# EAGLE design S7G7_footprint_simplified_w_ethernet_v1p7 (EAGLE 9.4.2)
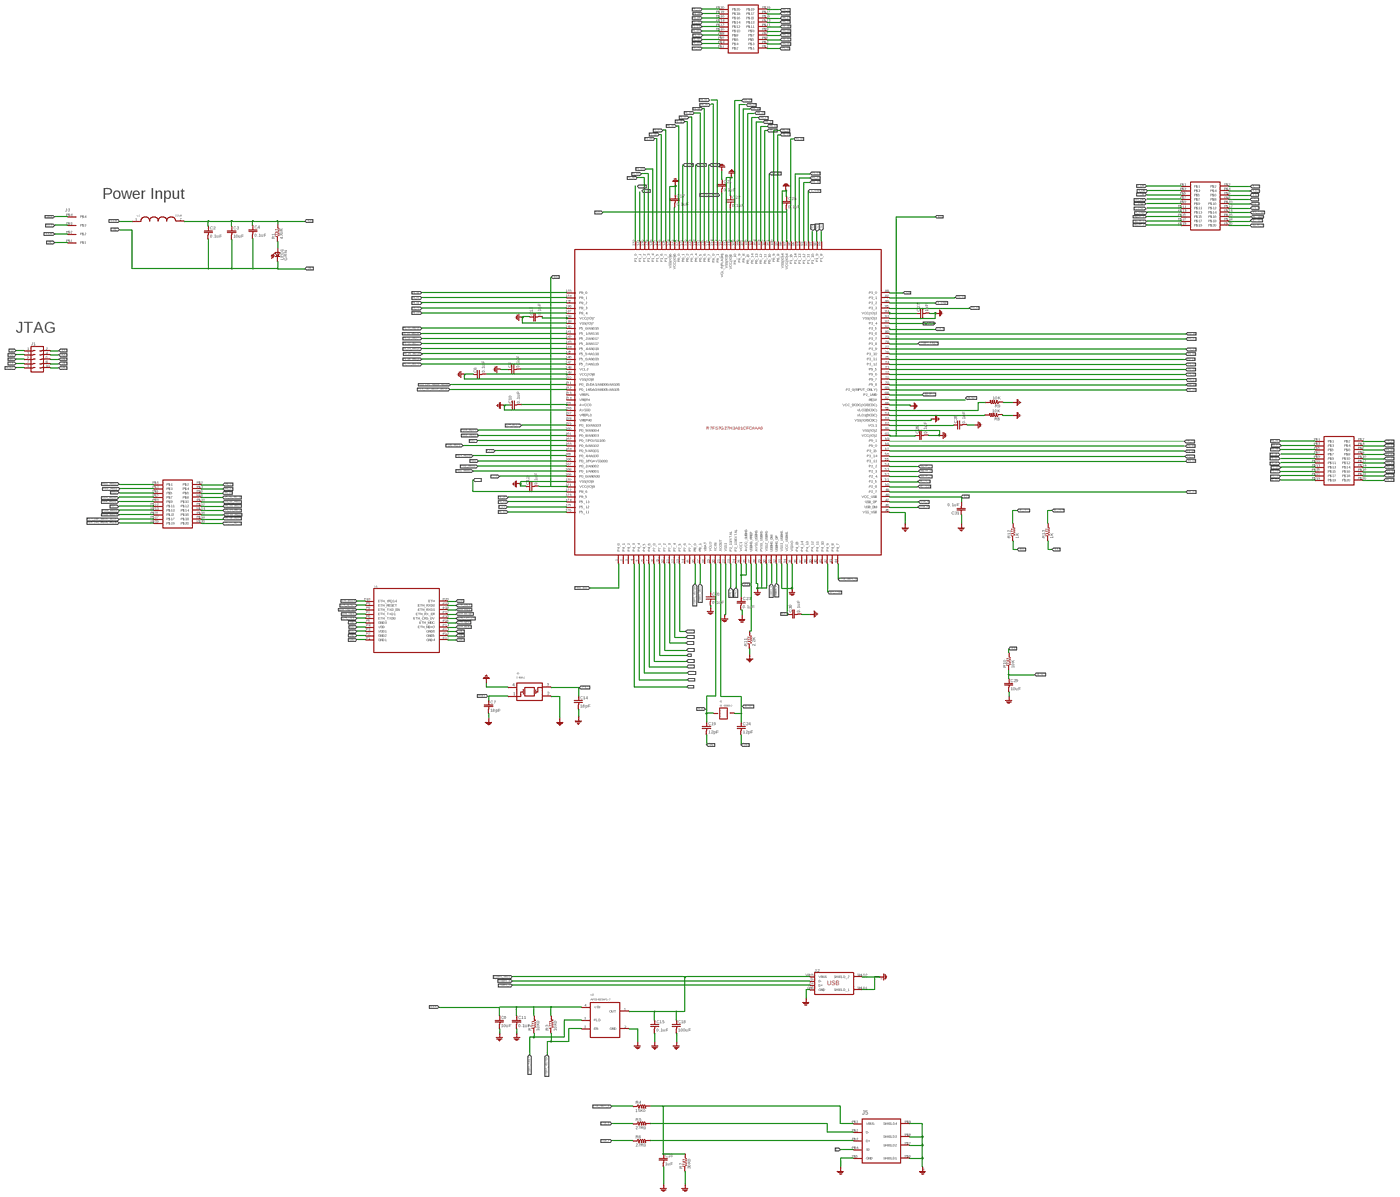
[diagram p0: schematic, sheet 1, overview]
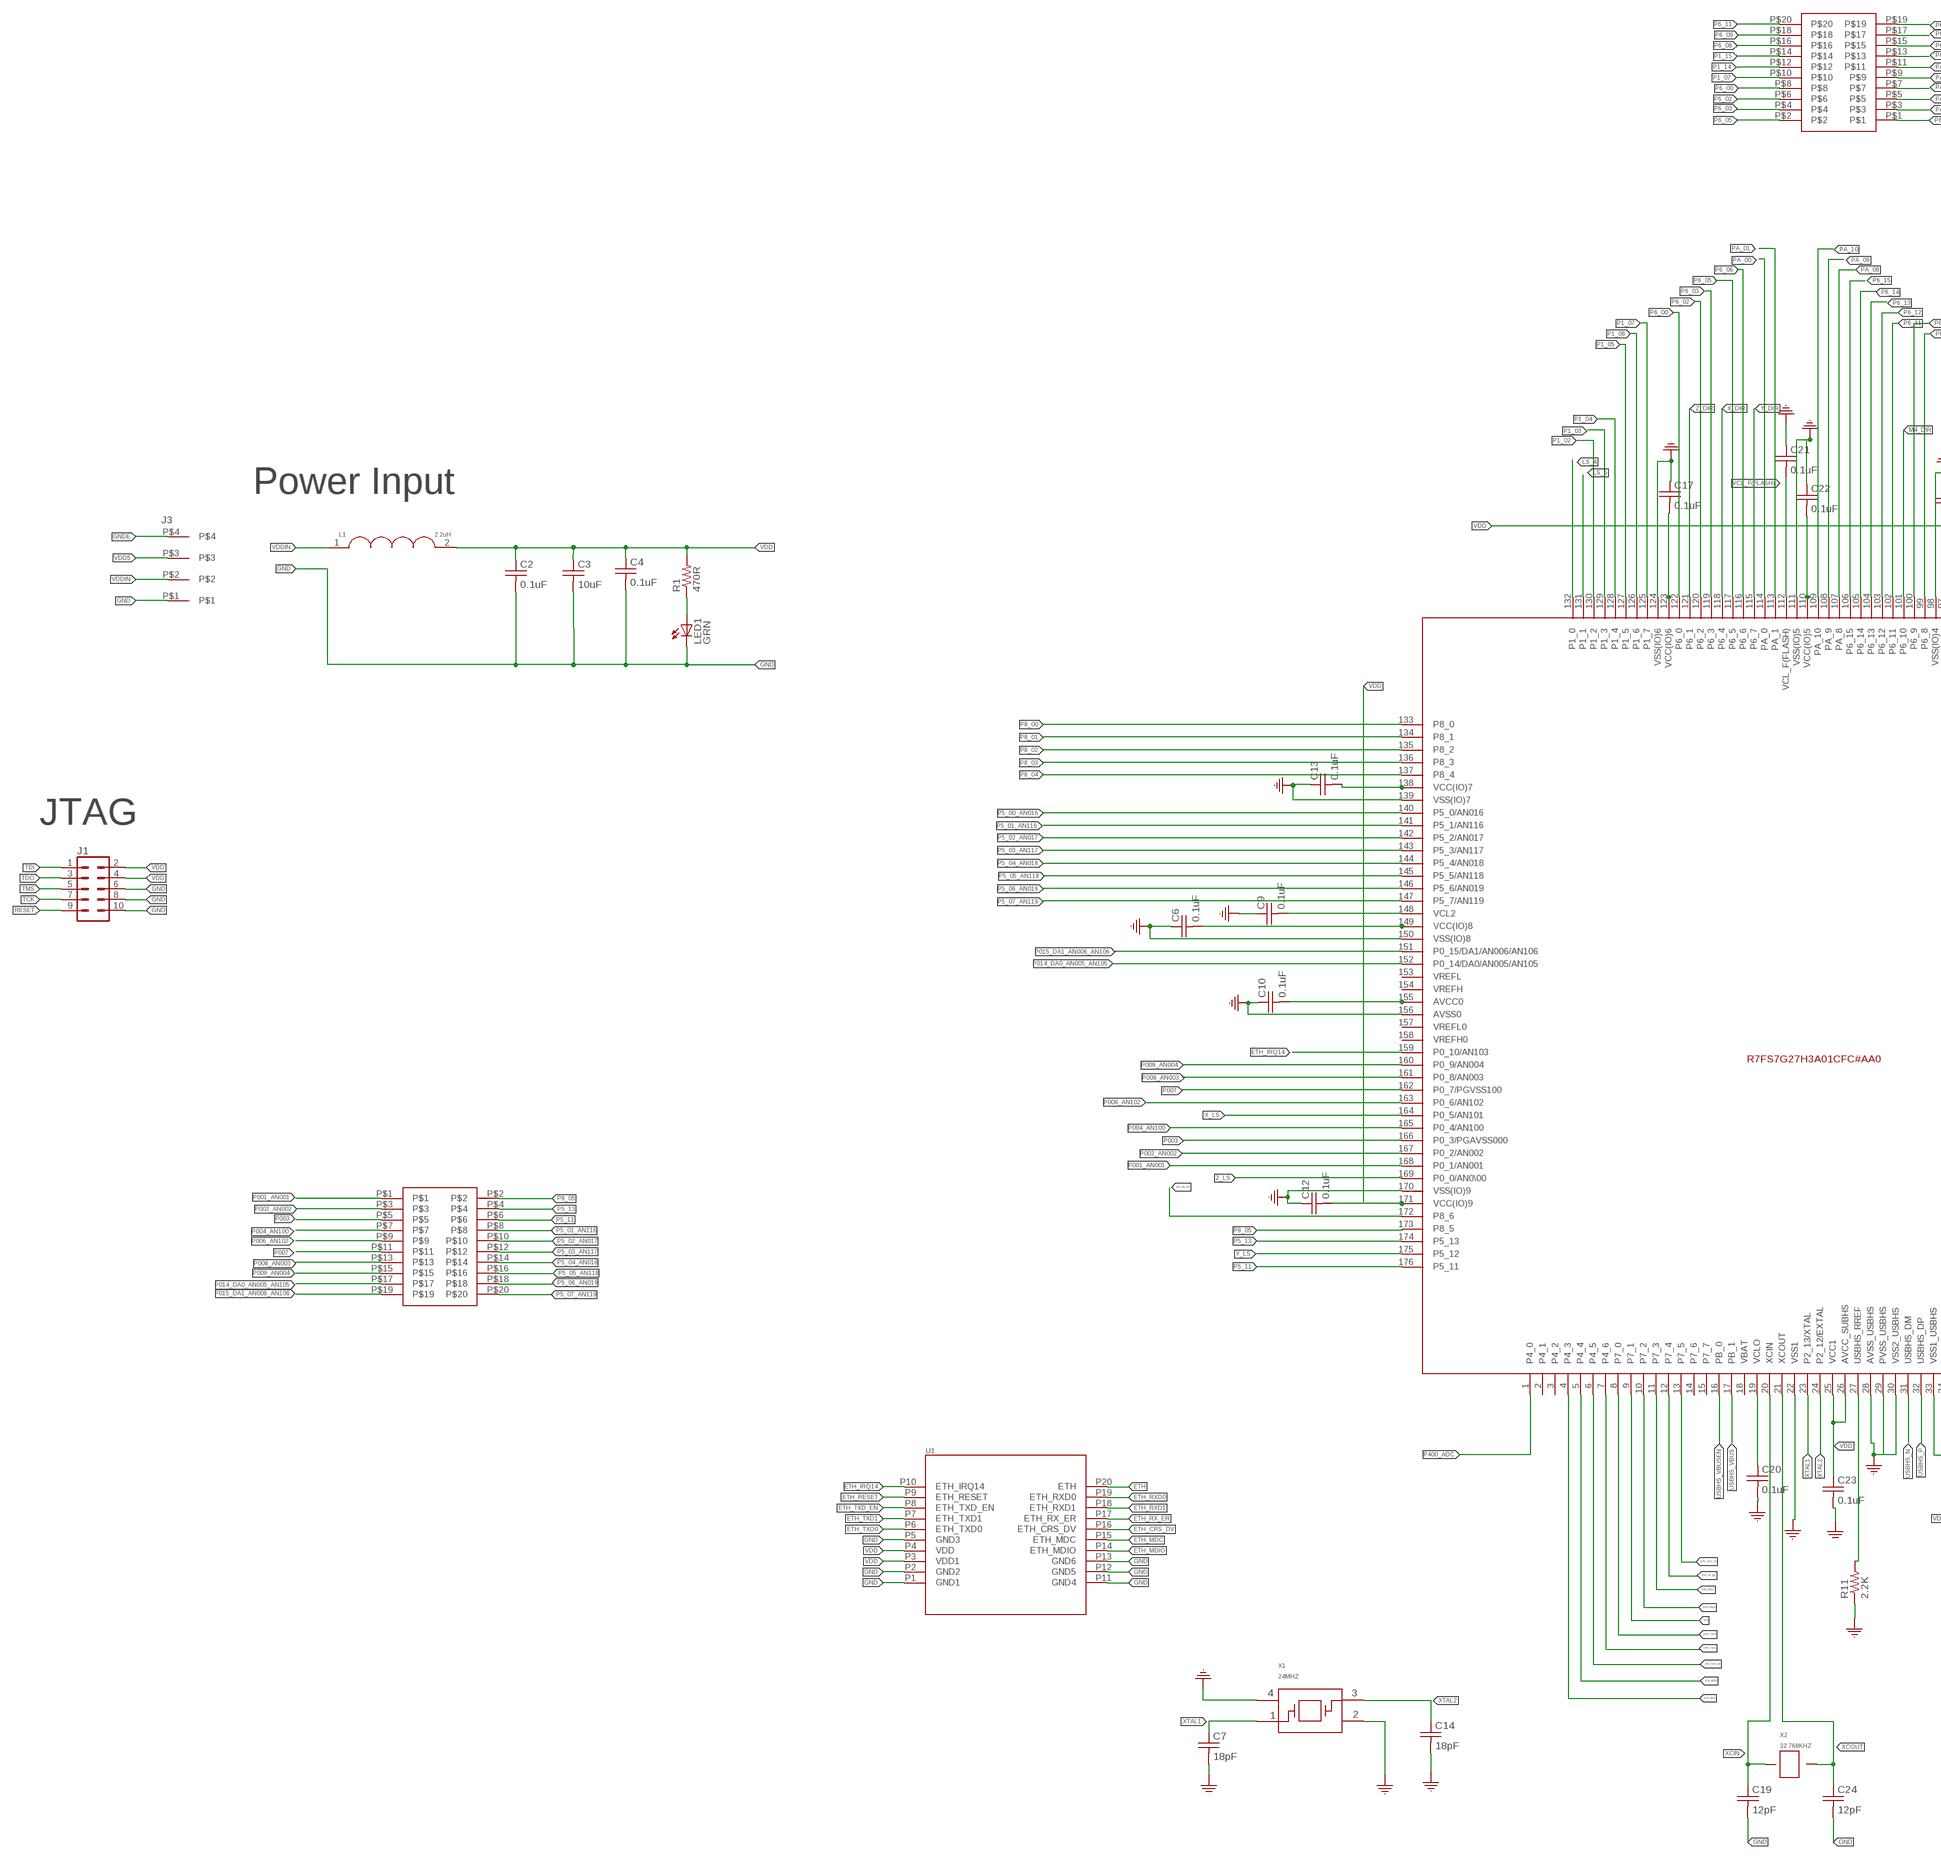
[diagram p1: schematic, sheet 1, part 1 of 4]
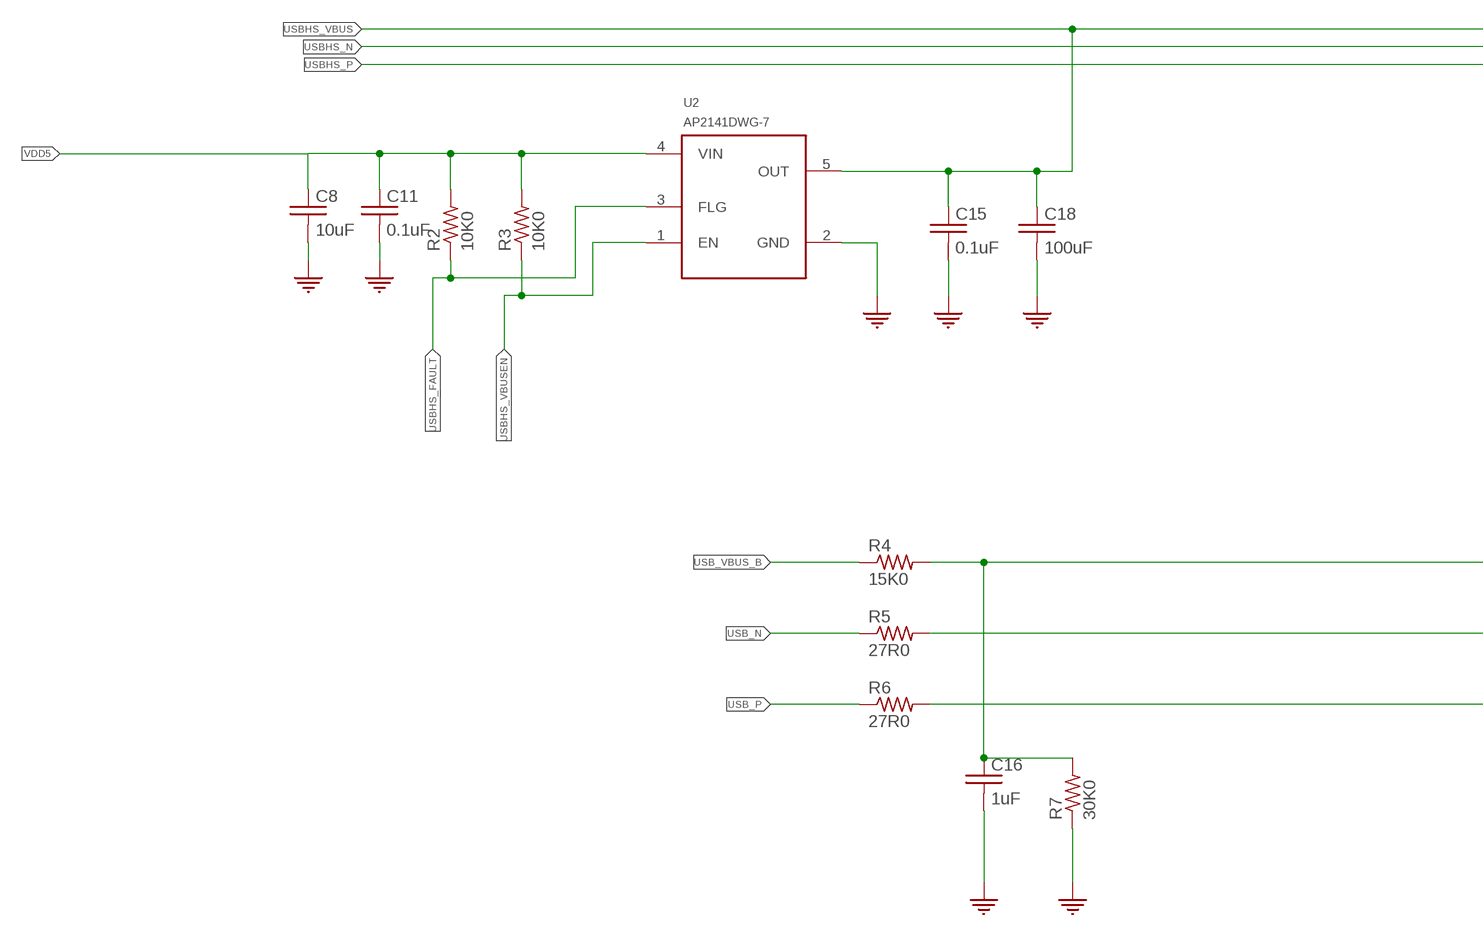
[diagram p2: schematic, sheet 1, part 2 of 4]
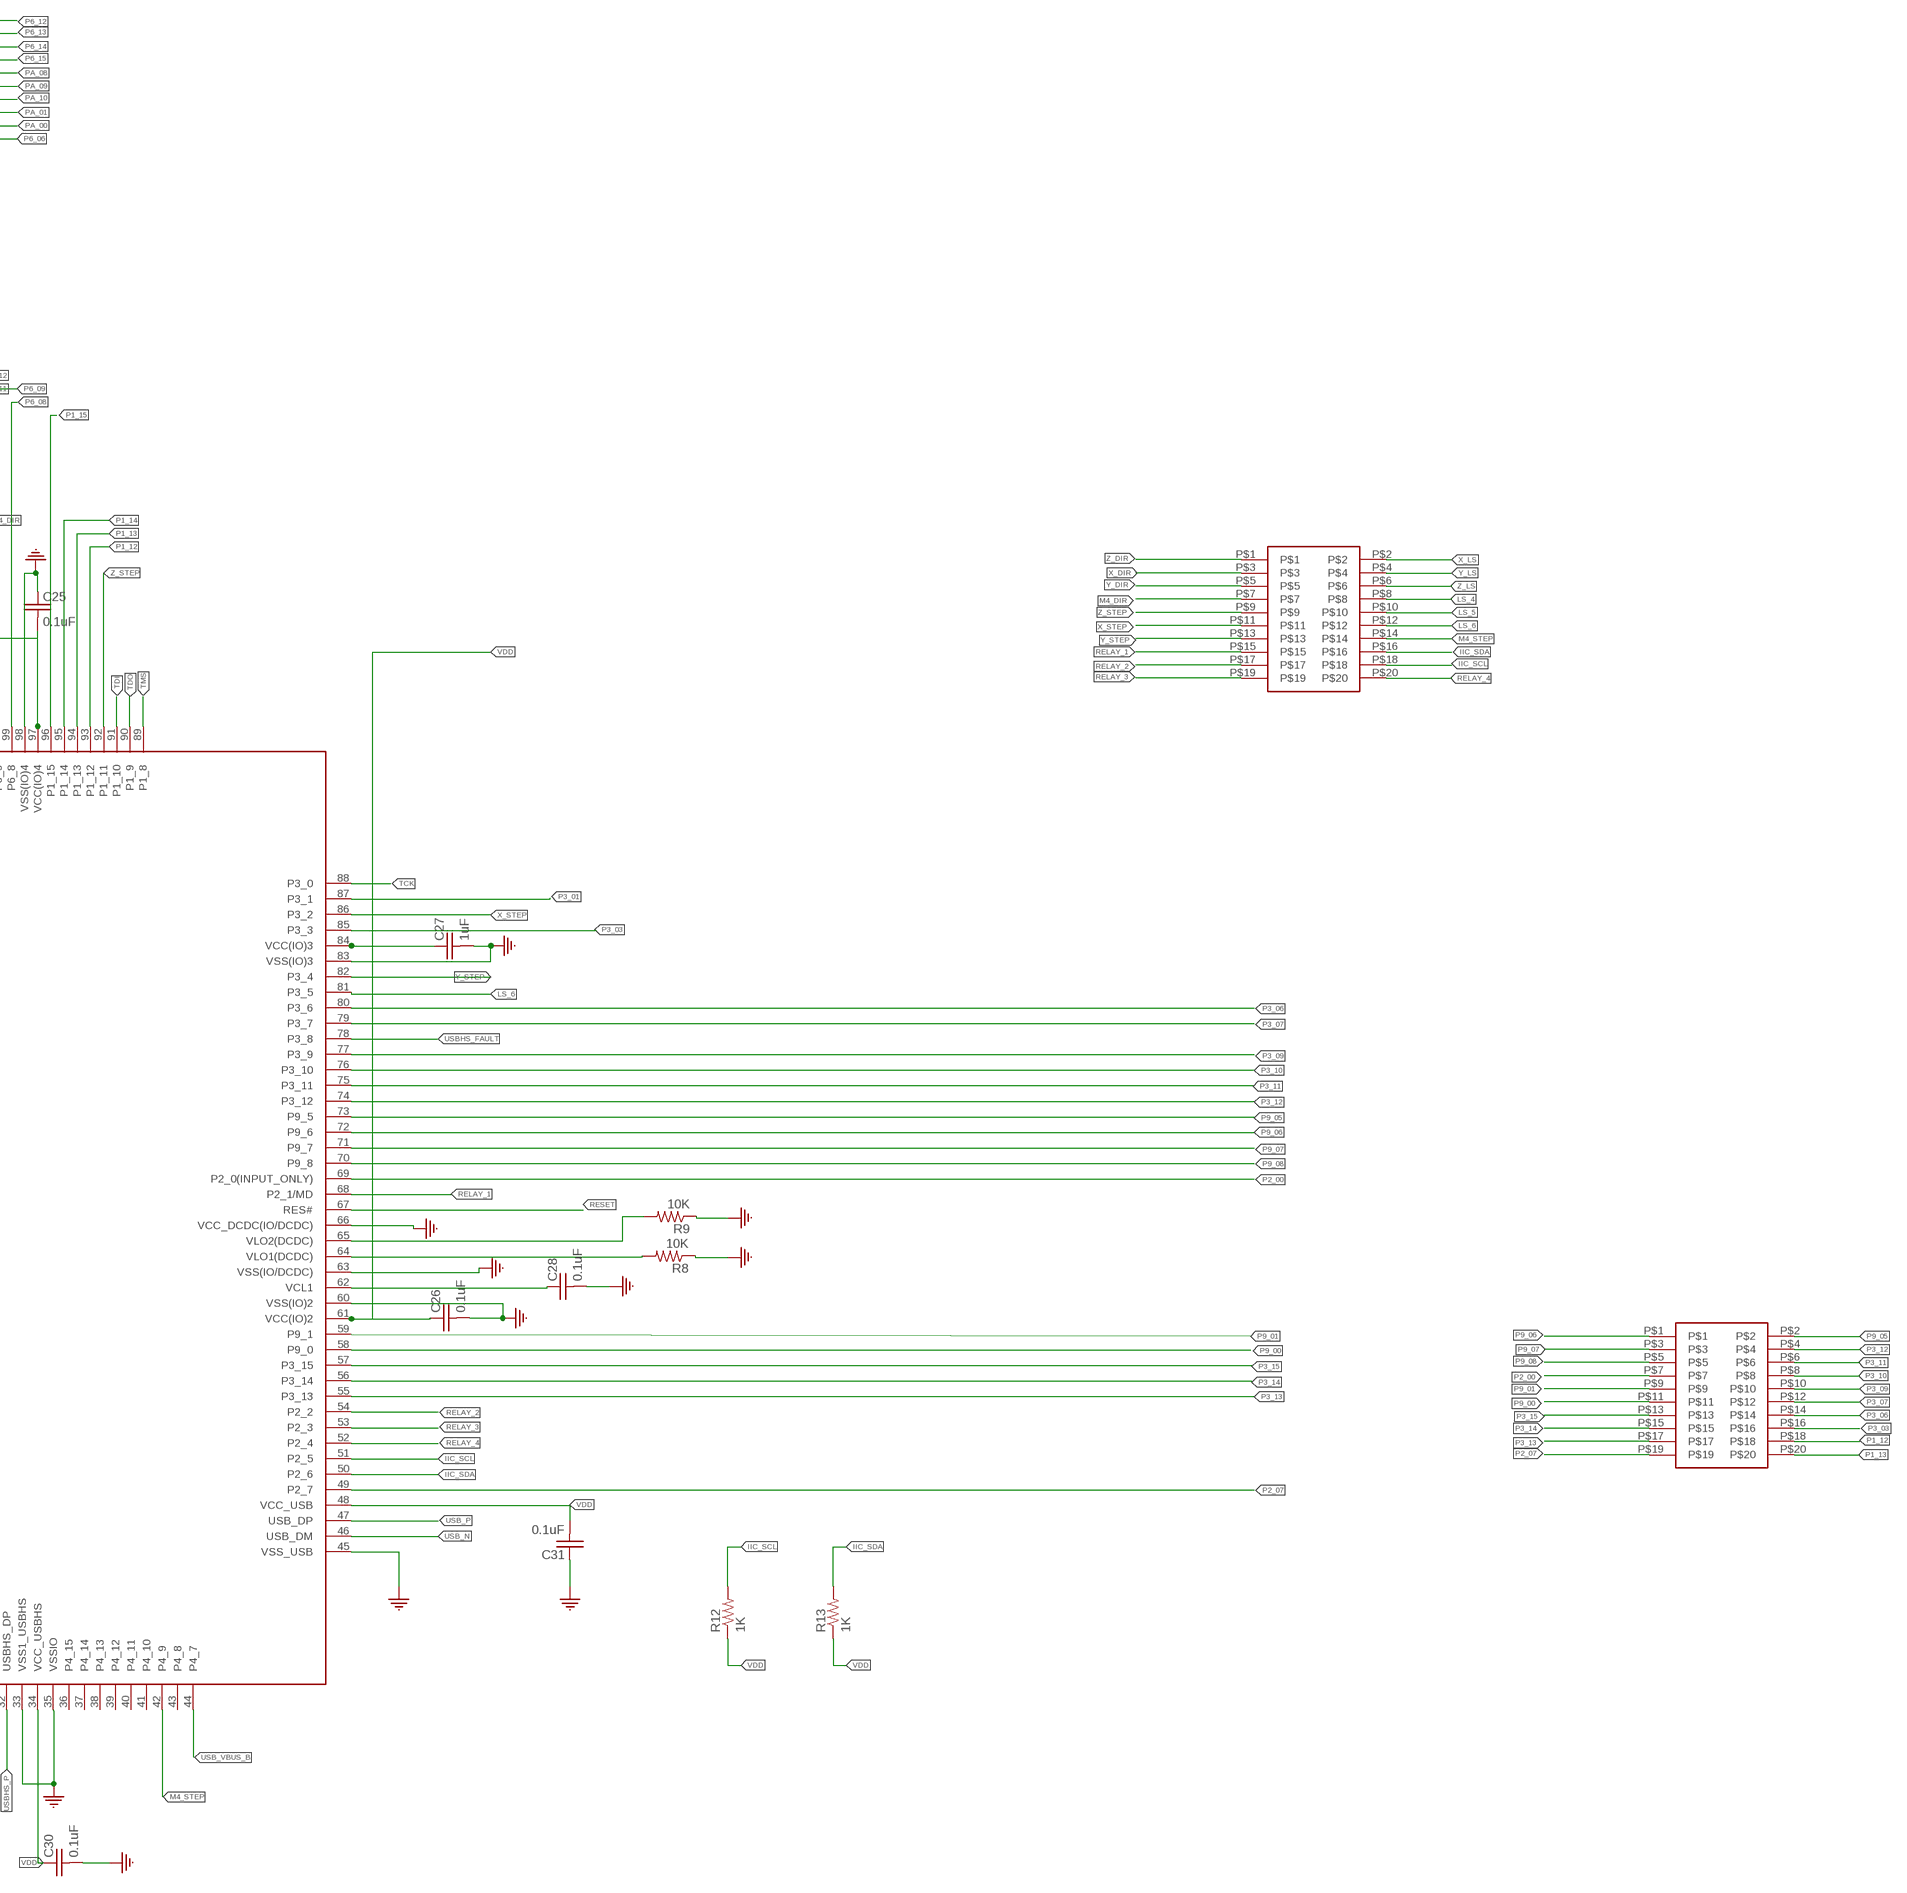
[diagram p3: schematic, sheet 1, part 3 of 4]
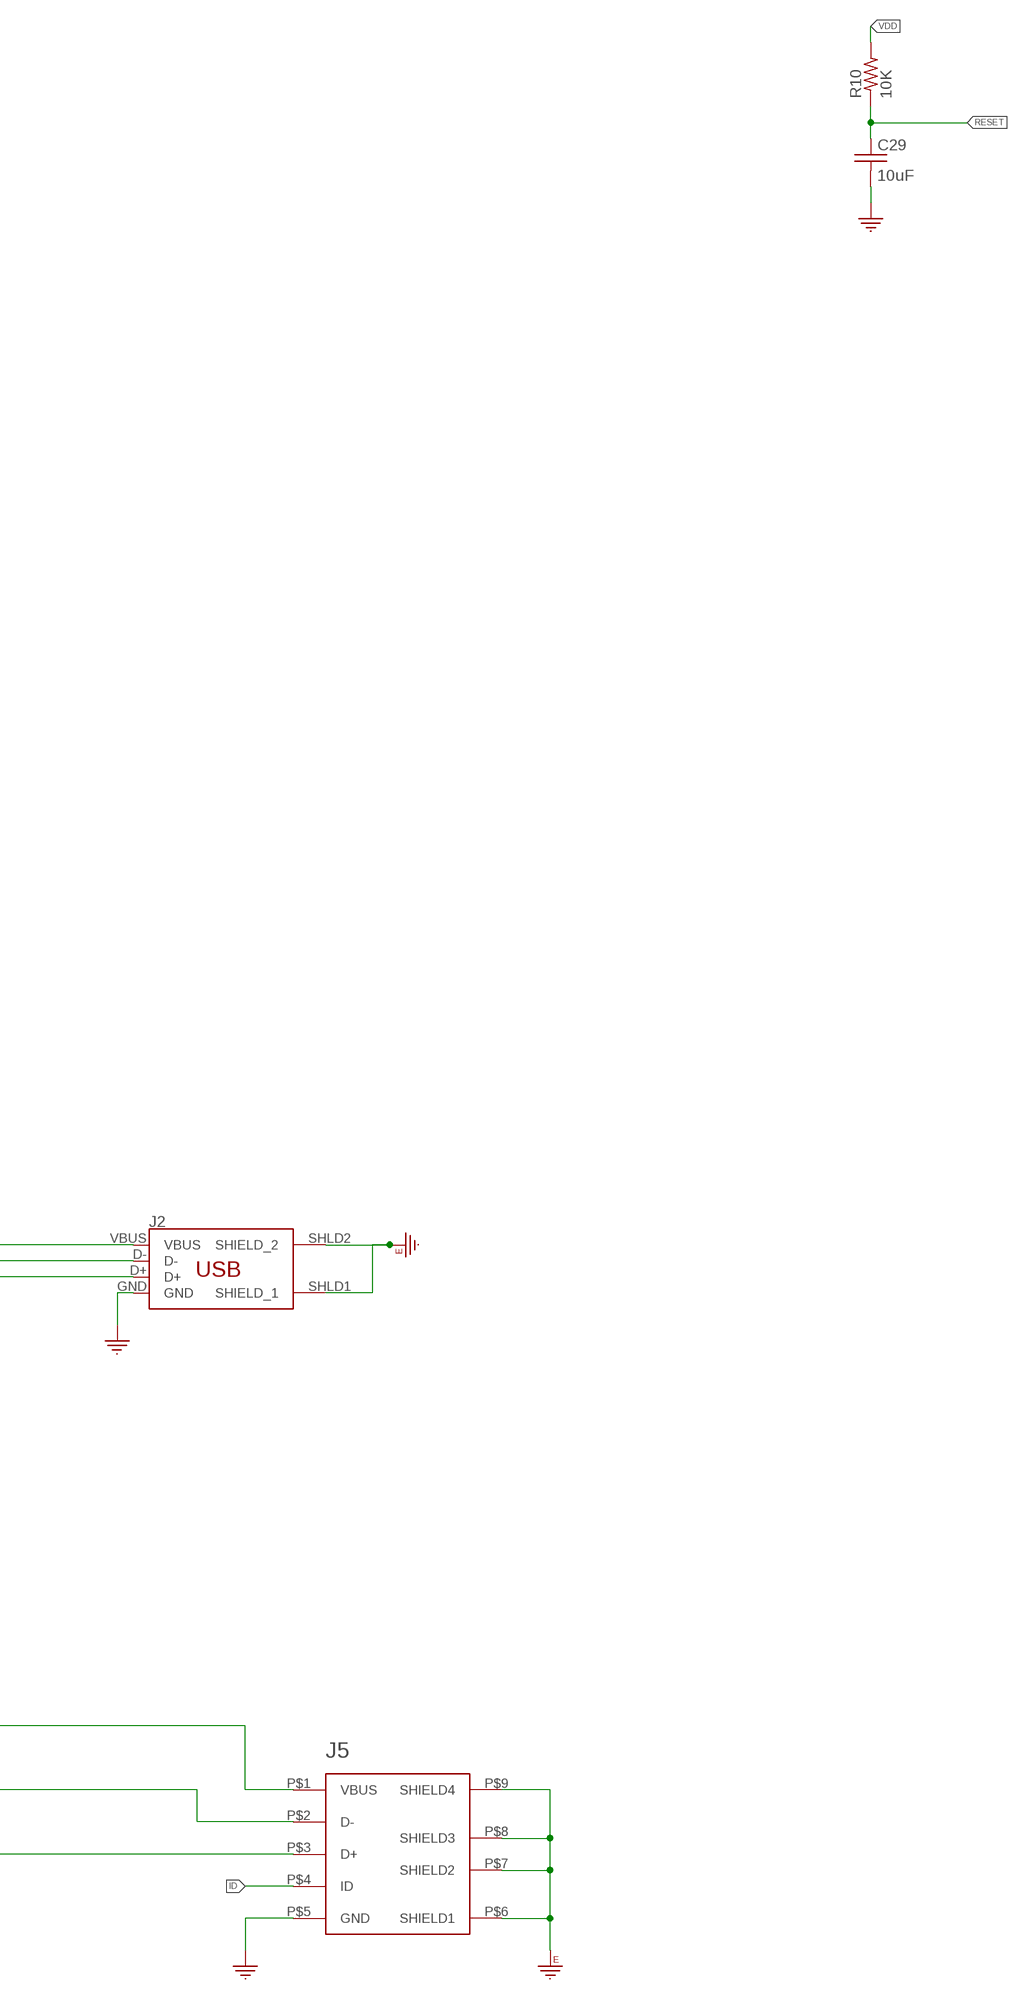
[diagram p4: schematic, sheet 1, part 4 of 4]

## Parts
C2  0.1uF  C_0402  [0402]
C3  10uF  C_0402  [0402]
C4  0.1uF  C_0402  [0402]
C6  0.1uF  C_0402  [0402]
C7  18pF  C_0402  [0402]
C8  10uF  C_0402  [0402]
C9  0.1uF  C_0402  [0402]
C10  0.1uF  C_0402  [0402]
C11  0.1uF  C_0402  [0402]
C12  0.1uF  C_0402  [0402]
C13  0.1uF  C_0402  [0402]
C14  18pF  C_0402  [0402]
C15  0.1uF  C_0402  [0402]
C16  1uF  C_0402  [0402]
C17  0.1uF  C_0402  [0402]
C18  100uF  C_1210  [C1210]
C19  12pF  C_0402  [0402]
C20  0.1uF  C_0402  [0402]
C21  0.1uF  C_0402  [0402]
C22  0.1uF  C_0402  [0402]
C23  0.1uF  C_0402  [0402]
C24  12pF  C_0402  [0402]
C25  0.1uF  C_0402  [0402]
C26  0.1uF  C_0402  [0402]
C27  1uF  C_0402  [0402]
C28  0.1uF  C_0402  [0402]
C29  10uF  C_0402  [0402]
C30  0.1uF  C_0402  [0402]
C31  0.1uF  C_0402  [0402]
J1  CONN_05X2PTH  [2X5]
J2  USB_A  [USB_A_SMT]
J3  3.81MM_1_X_4_RT_ANGLE_PLUG_HEADER  [1X4_3.81MM_PITCH]
J4  2_X_10_HEADER_GENERIC  [2_X_10_.1_INCH]
J5  USB_MICRO-B  [USB_MICRO-B]
JP1  2_X_10_HEADER_GENERIC  [2_X_10_.1_INCH]
JP2  2_X_10_HEADER_GENERIC  [2_X_10_.1_INCH]
JP3  2_X_10_HEADER_GENERIC  [2_X_10_.1_INCH]
L1  2.2uH  INDUCTOR_1008_2.2_MH_1.3A  [1008_(2520_METRIC)]
LED1  LED_0805_GREEN  [LED_0805_GREEN]
R1  470R  R_0402  [0402]
R2  10K0  R_0402  [0402]
R3  10K0  R_0402  [0402]
R4  15K0  R_0402  [0402]
R5  27R0  R_0402  [0402]
R6  27R0  R_0402  [0402]
R7  30K0  R_0402  [0402]
R8  10K  R_0402  [0402]
R9  10K  R_0402  [0402]
R10  10K  R_0402  [0402]
R11  2.2K  R_0402  [0402]
R12  1K  R_0402  [0402]
R13  1K  R_0402  [0402]
U1  ETHERNET_HAT  [ETHERNET_HAT]
U2  AP2141DWG-5  [SOT-23-5]
U5  S7G2_X_176  [LQFP176_24X24]
X1  24MHZ  XTAL_24_MHZ  [SMD_3225]
X2  32.768KHZ  XTAL_32.768KHZ  [SMD_X_2_PADS]

## Nets
D+: J5.P$3(D+) R6.P$2
D-: J5.P$2(D-) R5.P$2
ETH: U1.P20(ETH) U5.9(P7_1)
ETH_CRS_DV: U1.P16(ETH_CRS_DV) U5.13(P7_5)
ETH_IRQ14: U1.P10(ETH_IRQ14) U5.159(P0_10/AN103)
ETH_MDC: U1.P15(ETH_MDC) U5.4(P4_3)
ETH_MDIO: U1.P14(ETH_MDIO) U5.5(P4_4)
ETH_RESET: U1.P9(ETH_RESET) U5.172(P8_6)
ETH_RX_ER: U1.P17(ETH_RX_ER) U5.12(P7_4)
ETH_RXD0: U1.P19(ETH_RXD0) U5.10(P7_2)
ETH_RXD1: U1.P18(ETH_RXD1) U5.11(P7_3)
ETH_TXD0: U1.P6(ETH_TXD0) U5.8(P7_0)
ETH_TXD1: U1.P7(ETH_TXD1) U5.7(P4_6)
ETH_TXD_EN: U1.P8(ETH_TXD_EN) U5.6(P4_5)
GND: C2.P$2 C3.P$2 C4.P$2 C6.P$1 C7.P$2 C8.P$2 C9.P$1 C10.P$1 C11.P$2 C12.P$1 C13.P$1 C14.P$2 C15.P$2 C16.P$2 C17.P$1 C18.2 C19.P$2 C20.P$2 C21.P$1 C22.P$1 C23.P$2 C24.P$2 C25.P$1 C26.P$2 C27.P$2 C28.P$2 C29.P$2 C30.P$2 C31.P$1 J1.6 J1.8 J1.10 J2.GND J3.P$1 J5.P$5(GND) LED1.C R7.P$1 R8.P$1 R9.P$1 R11.P$1 U1.P1(GND1) U1.P2(GND2) U1.P5(GND3) U1.P11(GND4) U1.P12(GND5) U1.P13(GND6) U2.2(GND) U5.22(VSS1) U5.28(AVSS_USBHS) U5.29(PVSS_USBHS) U5.30(VSS2_USBHS) U5.33(VSS1_USBHS) U5.35(VSSIO) U5.45(VSS_USB) U5.60(VSS(IO)2) U5.63(VSS(IO/DCDC)) U5.66(VCC_DCDC(IO/DCDC)) U5.83(VSS(IO)3) U5.98(VSS(IO)4) U5.111(VSS(IO)5) U5.124(VSS(IO)6) U5.139(VSS(IO)7) U5.150(VSS(IO)8) U5.156(AVSS0) U5.170(VSS(IO)9) X1.2 X1.4
GNDE: J2.SHLD1(SHIELD_1) J2.SHLD2(SHIELD_2) J3.P$4 J5.P$6(SHIELD1) J5.P$7(SHIELD2) J5.P$8(SHIELD3) J5.P$9(SHIELD4)
ID: J5.P$4(ID)
IIC_SCL: J4.P$18 R12.P$2 U5.51(P2_5)
IIC_SDA: J4.P$16 R13.P$2 U5.50(P2_6)
LS_4: J4.P$8 U5.132(P1_0)
LS_5: J4.P$10 U5.131(P1_1)
LS_6: J4.P$12 U5.81(P3_5)
M4_DIR: J4.P$7 U5.101(P6_10)
M4_STEP: J4.P$14 U5.42(P4_9)
N$2: R11.P$2 U5.27(USBHS_RREF)
N$7: LED1.A R1.P$1
N$9: C9.P$2 U5.148(VCL2)
N$14: C20.P$1 U5.19(VCLO)
N$17: C28.P$1 U5.62(VCL1)
N$18: R8.P$2 U5.64(VLO1(DCDC))
N$19: R9.P$2 U5.65(VLO2(DCDC))
P1_02: U5.130(P1_2)
P1_03: U5.129(P1_3)
P1_04: U5.128(P1_4)
P1_05: U5.127(P1_5)
P1_06: U5.126(P1_6)
P1_07: JP3.P$10 U5.125(P1_7)
P1_12: JP2.P$18 U5.93(P1_12)
P1_13: JP2.P$20 U5.94(P1_13)
P1_14: JP3.P$12 U5.95(P1_14)
P1_15: JP3.P$14 U5.96(P1_15)
P001_AN001: JP1.P$1 U5.168(P0_1/AN001)
P2_00: JP2.P$7 U5.69(P2_0(INPUT_ONLY))
P2_07: JP2.P$19 U5.49(P2_7)
P002_AN002: JP1.P$3 U5.167(P0_2/AN002)
P003: JP1.P$5 U5.166(P0_3/PGAVSS000)
P3_01: U5.87(P3_1)
P3_03: JP2.P$16 U5.85(P3_3)
P3_06: JP2.P$14 U5.80(P3_6)
P3_07: JP2.P$12 U5.79(P3_7)
P3_09: JP2.P$10 U5.77(P3_9)
P3_10: JP2.P$8 U5.76(P3_10)
P3_11: JP2.P$6 U5.75(P3_11)
P3_12: JP2.P$4 U5.74(P3_12)
P3_13: JP2.P$17 U5.55(P3_13)
P3_14: JP2.P$15 U5.56(P3_14)
P3_15: JP2.P$13 U5.57(P3_15)
P004_AN100: JP1.P$7 U5.165(P0_4/AN100)
P5_00_AN016: U5.140(P5_0/AN016)
P5_01_AN116: JP1.P$8 U5.141(P5_1/AN116)
P5_02_AN017: JP1.P$10 U5.142(P5_2/AN017)
P5_03_AN117: JP1.P$12 U5.143(P5_3/AN117)
P5_04_AN018: JP1.P$14 U5.144(P5_4/AN018)
P5_05_AN118: JP1.P$16 U5.145(P5_5/AN118)
P5_06_AN019: JP1.P$18 U5.146(P5_6/AN019)
P5_07_AN119: JP1.P$20 U5.147(P5_7/AN119)
P5_11: JP1.P$6 U5.176(P5_11)
P5_13: JP1.P$4 U5.174(P5_13)
P6_00: JP3.P$8 U5.122(P6_0)
P6_02: JP3.P$6 U5.120(P6_2)
P6_03: JP3.P$4 U5.119(P6_3)
P6_05: JP3.P$2 U5.117(P6_5)
P6_06: JP3.P$1 U5.116(P6_6)
P6_08: JP3.P$16 U5.99(P6_8)
P6_09: JP3.P$18 U5.100(P6_9)
P6_11: JP3.P$20 U5.102(P6_11)
P6_12: JP3.P$19 U5.103(P6_12)
P6_13: JP3.P$17 U5.104(P6_13)
P6_14: JP3.P$15 U5.105(P6_14)
P6_15: JP3.P$13 U5.106(P6_15)
P006_AN102: JP1.P$9 U5.163(P0_6/AN102)
P007: JP1.P$11 U5.162(P0_7/PGVSS100)
P8_00: U5.133(P8_0)
P8_01: U5.134(P8_1)
P8_02: U5.135(P8_2)
P8_03: U5.136(P8_3)
P8_04: U5.137(P8_4)
P8_05: JP1.P$2 U5.173(P8_5)
P008_AN003: JP1.P$13 U5.161(P0_8/AN003)
P9_00: JP2.P$11 U5.58(P9_0)
P9_01: JP2.P$9 U5.59(P9_1)
P9_05: JP2.P$2 U5.73(P9_5)
P9_06: JP2.P$1 U5.72(P9_6)
P9_07: JP2.P$3 U5.71(P9_7)
P9_08: JP2.P$5 U5.70(P9_8)
P009_AN004: JP1.P$15 U5.160(P0_9/AN004)
P014_DA0_AN005_AN105: JP1.P$17 U5.152(P0_14/DA0/AN005/AN105)
P015_DA1_AN006_AN106: JP1.P$19 U5.151(P0_15/DA1/AN006/AN106)
P400_ADC: U5.1(P4_0)
P706: U5.14(P7_6)
PA_00: JP3.P$3 U5.114(PA_0)
PA_01: JP3.P$5 U5.113(PA_1)
PA_08: JP3.P$11 U5.107(PA_8)
PA_09: JP3.P$9 U5.108(PA_9)
PA_10: JP3.P$7 U5.109(PA_10)
RELAY_1: J4.P$15 U5.68(P2_1/MD)
RELAY_2: J4.P$17 U5.54(P2_2)
RELAY_3: J4.P$19 U5.53(P2_3)
RELAY_4: J4.P$20 U5.52(P2_4)
RESET: C29.P$1 J1.9 R10.P$1 U5.67(RES#)
TCK: J1.7 U5.88(P3_0)
TDI: J1.1 U5.91(P1_10)
TDO: J1.3 U5.90(P1_9)
TMS: J1.5 U5.89(P1_8)
USB_N: R5.P$1 U5.46(USB_DM)
USB_P: R6.P$1 U5.47(USB_DP)
USB_VBUS_B: R4.P$1 U5.44(P4_7)
USBHS_FAULT: R2.P$1 U2.3(FLG) U5.78(P3_8)
USBHS_N: J2.D- U5.31(USBHS_DM)
USBHS_P: J2.D+ U5.32(USBHS_DP)
USBHS_VBUS: C15.P$1 C18.1 J2.VBUS U2.5(OUT) U5.17(PB_1)
USBHS_VBUSEN: R3.P$1 U2.1(EN) U5.16(PB_0)
VBUS: C16.P$1 J5.P$1(VBUS) R4.P$2 R7.P$2
VCL_F(FLASH): C21.P$2 U5.112(VCL_F(FLASH))
VDD: C2.P$1 C3.P$1 C4.P$1 C6.P$2 C10.P$2 C12.P$2 C13.P$2 C17.P$2 C22.P$2 C23.P$1 C25.P$2 C26.P$1 C27.P$1 C30.P$1 C31.P$2 J1.2 J1.4 L1.2 R1.P$2 R10.P$2 R12.P$1 R13.P$1 U1.P3(VDD1) U1.P4(VDD) U5.25(VCC1) U5.26(AVCC_SUBHS) U5.34(VCC_USBHS) U5.48(VCC_USB) U5.61(VCC(IO)2) U5.84(VCC(IO)3) U5.97(VCC(IO)4) U5.110(VCC(IO)5) U5.123(VCC(IO)6) U5.138(VCC(IO)7) U5.149(VCC(IO)8) U5.155(AVCC0) U5.171(VCC(IO)9)
VDD5: C8.P$1 C11.P$1 J3.P$3 R2.P$2 R3.P$2 U2.4(VIN)
VDDIN: J3.P$2 L1.1
X_DIR: J4.P$3 U5.118(P6_4)
X_LS: J4.P$2 U5.164(P0_5/AN101)
X_STEP: J4.P$11 U5.86(P3_2)
XCIN: C19.P$1 U5.20(XCIN) X2.P$1
XCOUT: C24.P$1 U5.21(XCOUT) X2.P$2
XTAL1: C7.P$1 U5.23(P2_13/XTAL) X1.1
XTAL2: C14.P$1 U5.24(P2_12/EXTAL) X1.3
Y_DIR: J4.P$5 U5.115(P6_7)
Y_LS: J4.P$4 U5.175(P5_12)
Y_STEP: J4.P$13 U5.82(P3_4)
Z_DIR: J4.P$1 U5.121(P6_1)
Z_LS: J4.P$6 U5.169(P0_0/AN0\00)
Z_STEP: J4.P$9 U5.92(P1_11)
Unconnected: U5.2(P4_1) U5.3(P4_2) U5.15(P7_7) U5.18(VBAT) U5.36(P4_15) U5.37(P4_14) U5.38(P4_13) U5.39(P4_12) U5.40(P4_11) U5.41(P4_10) U5.43(P4_8) U5.153(VREFL) U5.154(VREFH) U5.157(VREFL0) U5.158(VREFH0)

## Notes on the sheet
- Power Input
- JTAG

## Library data of the parts
C2-C4 C6-C17 C19-C31 = 3D_MIG_Controller:C_0402
C18 = 3D_MIG_Controller:C_1210
J1 = 3D_MIG_Controller:CONN_05X2: Multi connection point. Often used as Generic Header-pin footprint for 0.1 inch spaced/style header connections For AVR SPI programming port, see special device with nice symbol: "AVR_SPI_PROG_5x2.dev" You can populate with any combo of single row headers, but if you'd like an exact match, check these: 2x5 AVR ICSP Male Header <https://www.sparkfun.com/products/778> (PRT-00778) 2x5 Pin Shrouded Header <https://www.sparkfun.com/products/8506> (PRT-08506) On any of the 0.1 inch spaced packages, you can populate with these: Break Away Headers - Straight <https://www.sparkfun.com/products/116> (PRT-00116) Break Away Male Headers - Right Angle <https://www.sparkfun.com/products/553> (PRT-00553) Female Headers <https://www.sparkfun.com/products/115> (PRT-00115) Break Away Headers - Machine Pin <https://www.sparkfun.com/products/117> (PRT-00117) Break Away Female Headers - Swiss Machine Pin <https://www.sparkfun.com/products/743> (PRT-00743) Special note: the shrouded connector mates well with our 5x2 ribbon cables: 2x5 Pin IDC Ribbon Cable <https://www.sparkfun.com/products/8535> (PRT-08535); PROD_ID: CONN-08499; SF_ID: PRT-0778
J2 = 3D_MIG_Controller:USB_A: USB-A Connector Male and female variants, as well as PTH and SMT variants SparkFun Products: SparkFun XBee Explorer Dongle <https://www.sparkfun.com/products/11697> PTH Male SparkFun MicroView-USB Programmer <https://www.sparkfun.com/products/12924> SMT Male SparkFun USB Type A Female Breakout <https://www.sparkfun.com/products/12700> SMT Female
J3 = 3D_MIG_Controller:3.81MM_1_X_4_RT_ANGLE_PLUG_HEADER
J4 JP1-JP3 = 3D_MIG_Controller:2_X_10_HEADER_GENERIC
J5 = 3D_MIG_Controller:USB_MICRO-B
L1 = 3D_MIG_Controller:INDUCTOR_1008_2.2_MH_1.3A
LED1 = 3D_MIG_Controller:LED_0805_GREEN
R1-R13 = 3D_MIG_Controller:R_0402
U1 = 3D_MIG_Controller:ETHERNET_HAT
U2 = 3D_MIG_Controller:AP2141DWG-5
U5 = 3D_MIG_Controller:S7G2_X_176
X1 = 3D_MIG_Controller:XTAL_24_MHZ
X2 = 3D_MIG_Controller:XTAL_32.768KHZ

## Board
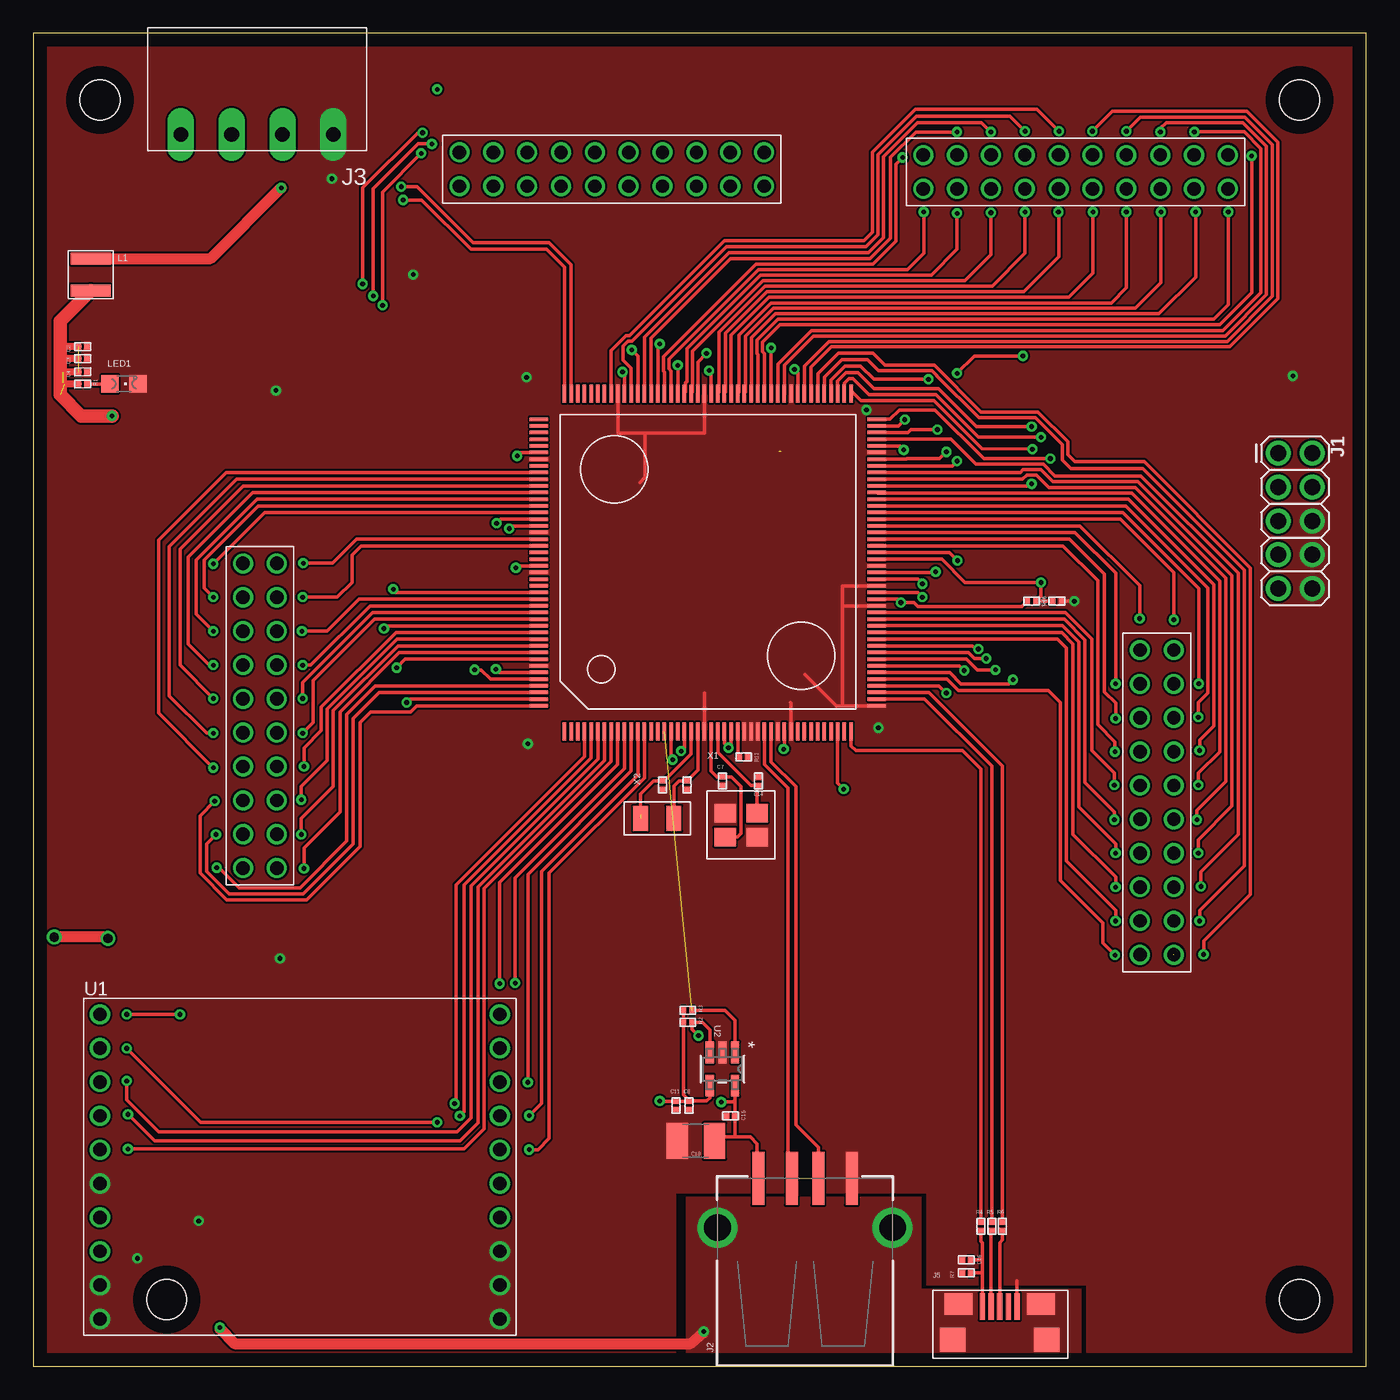
[diagram p5: board, top side]
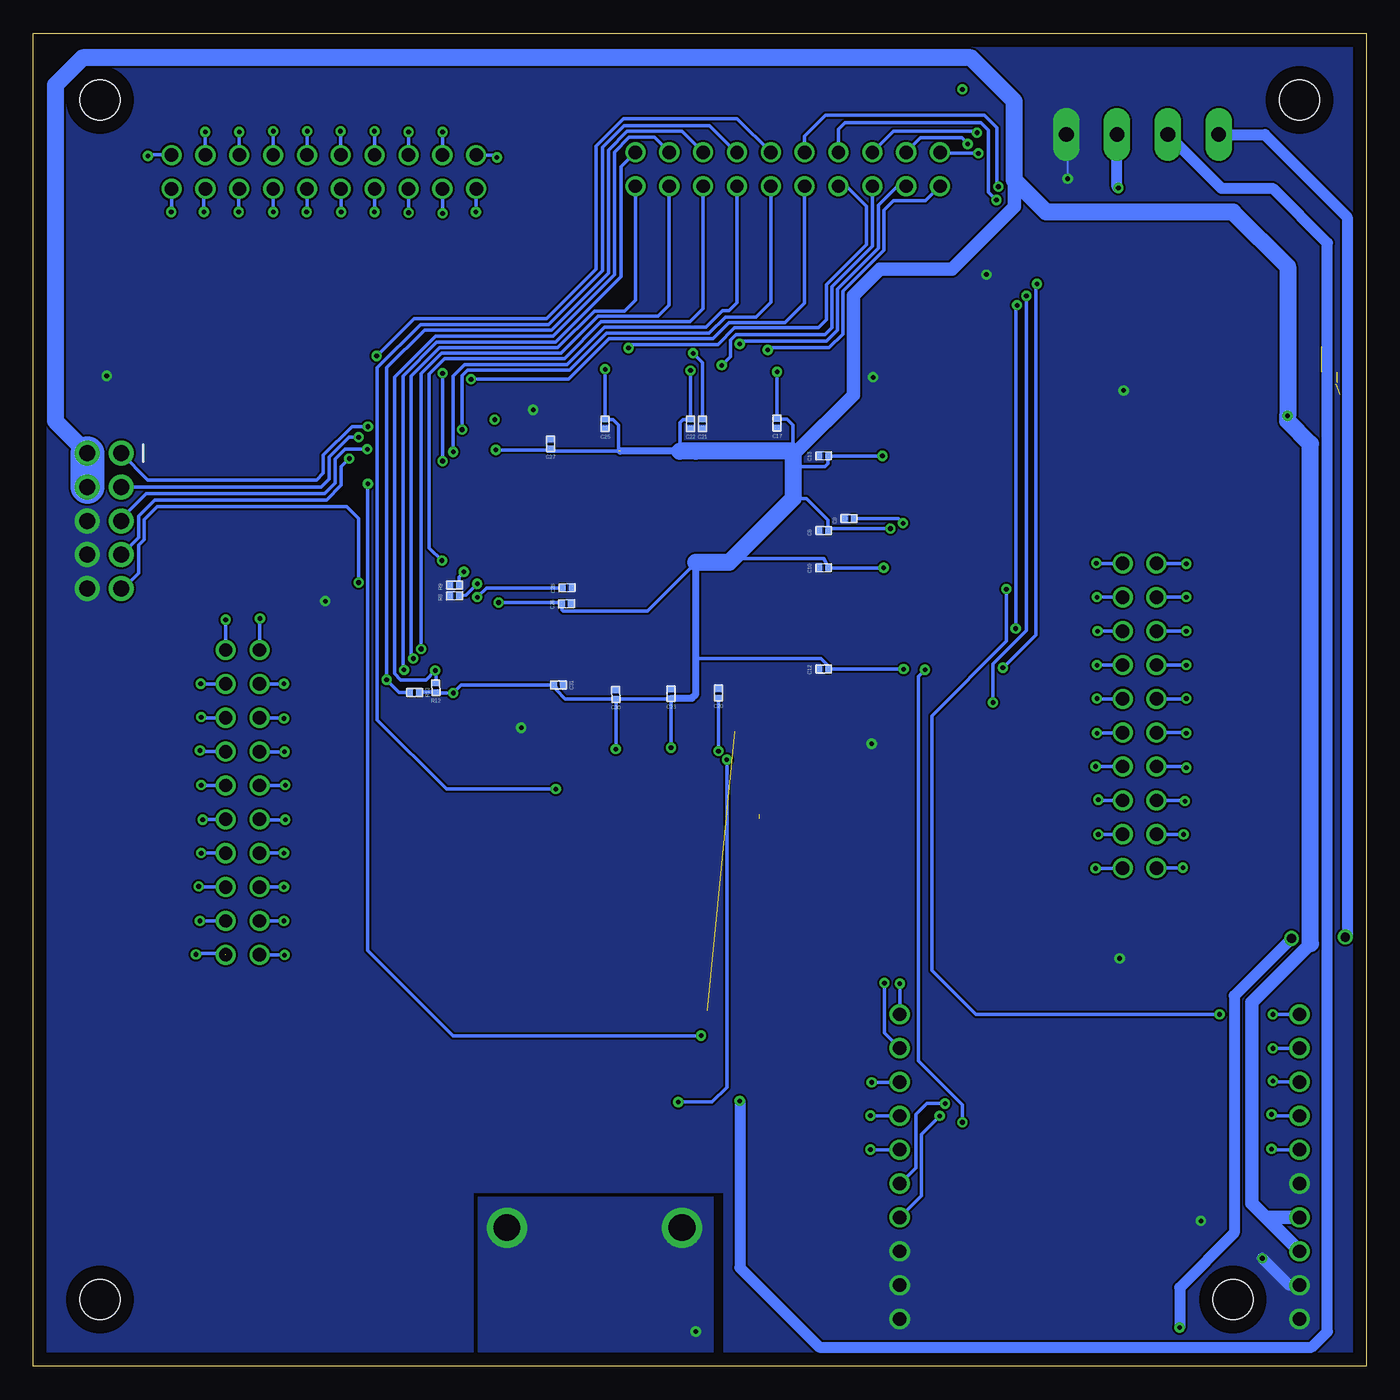
[diagram p6: board, bottom side, seen from below]

Size 100 x 100 mm. Coordinates in mm from the lower left corner, seen from the top.
Outline: 0,0 100,0 100,100 0,100 0,0
Copper layers (1*16): Top 0.035mm / dielectric 1.5mm / Bottom 0.035mm
Design rules "default": minimum track width 6mil, minimum drill 0.35mm, track to track 6mil, track to pad 6mil, pad to pad 6mil, via to via 6mil, smd to smd 6mil, copper to edge 40mil, drill to drill 6mil, minimum pad ring 10mil, minimum via ring 8mil, stop-mask expansion 4mil, vias tented up to drill 0mil, thermal gap 10mil
Holes 3 mm at 5,95 95,95 95,5 10,5

### Footprints (pad centres in the part's own frame; a part is rotated, then mirrored left to right if it is on the bottom)
0402 = smd 0.5 x 0.4: P$1 0,0.325; P$2 0,-0.325
C1210 = smd 1.6 x 2.7: 1 -1.4,0; 2 1.4,0
2X5 = drill 1.2 pad 1.88: 1 0,0; 2 0,2.54; 3 2.54,0; 4 2.54,2.54; 5 5.08,0; 6 5.08,2.54; 7 7.62,0; 8 7.62,2.54; 9 10.16,0; 10 10.16,2.54
USB_A_SMT = smd 4 x 0.9: D+ 6.7,-1; D- 6.7,1; GND 6.7,-3.5; VBUS 6.7,3.5 | drill 2: SHLD1 3,-6.566; SHLD2 3,6.566
1X4_3.81MM_PITCH = drill 1.1 pad 2 long: P$1 0,0; P$2 3.81,0; P$3 7.62,0; P$4 11.43,0
2_X_10_.1_INCH = drill 1: P$1 -11.43,-1.27; P$2 -11.43,1.27; P$3 -8.89,-1.27; P$4 -8.89,1.27; P$5 -6.35,-1.27; P$6 -6.35,1.27; P$7 -3.81,-1.27; P$8 -3.81,1.27; P$9 -1.27,-1.27; P$10 -1.27,1.27; P$11 1.27,-1.27; P$12 1.27,1.27; P$13 3.81,-1.27; P$14 3.81,1.27; P$15 6.35,-1.27; P$16 6.35,1.27; P$17 8.89,-1.27; P$18 8.89,1.27; P$19 11.43,-1.27; P$20 11.43,1.27
USB_MICRO-B = smd 0.4 x 2: P$1 -1.3,2.475; P$2 -0.65,2.475; P$3 0,2.475; P$4 0.65,2.475; P$5 1.3,2.475 | smd 2.1 x 1.6: P$6 -3.1,2.675; P$7 3.1,2.675 | smd 1.9 x 1.8: P$8 -3.525,0; P$9 3.525,0
1008_(2520_METRIC) = smd 3 x 0.9: 1 0,1.2; 2 0,-1.2
LED_0805_GREEN = smd 1.3 x 1.3: A 0,-1.05; C 0,1.05
ETHERNET_HAT = drill 1: P1 -15.3,-10.96; P2 -15.3,-8.42; P3 -15.3,-5.88; P4 -15.3,-3.34; P5 -15.3,-0.8; P6 -15.3,1.74; P7 -15.3,4.28; P8 -15.3,6.82; P9 -15.3,9.36; P10 -15.3,11.9; P11 14.7,-10.96; P12 14.7,-8.42; P13 14.7,-5.88; P14 14.7,-3.34; P15 14.7,-0.8; P16 14.7,1.74; P17 14.7,4.28; P18 14.7,6.82; P19 14.7,9.36; P20 14.7,11.9
SOT-23-5 = smd 1.626 x 0.61: 1 -1.245,0.95; 2 -1.245,0; 3 -1.245,-0.95; 4 1.245,-0.95; 5 1.245,0.95
LQFP176_24X24 = smd 1.372 x 0.254: 1 -12.675,10.75; 2 -12.675,10.25; 3 -12.675,9.75; 4 -12.675,9.25; 5 -12.675,8.75; 6 -12.675,8.25; 7 -12.675,7.75; 8 -12.675,7.25; 9 -12.675,6.75; 10 -12.675,6.25; 11 -12.675,5.75; 12 -12.675,5.25; 13 -12.675,4.75; 14 -12.675,4.25; 15 -12.675,3.75; 16 -12.675,3.25; 17 -12.675,2.75; 18 -12.675,2.25; 19 -12.675,1.75; 20 -12.675,1.25; 21 -12.675,0.75; 22 -12.675,0.25; 23 -12.675,-0.25; 24 -12.675,-0.75; 25 -12.675,-1.25; 26 -12.675,-1.75; 27 -12.675,-2.25; 28 -12.675,-2.75; 29 -12.675,-3.25; 30 -12.675,-3.75; 31 -12.675,-4.25; 32 -12.675,-4.75; 33 -12.675,-5.25; 34 -12.675,-5.75; 35 -12.675,-6.25; 36 -12.675,-6.75; 37 -12.675,-7.25; 38 -12.675,-7.75; 39 -12.675,-8.25; 40 -12.675,-8.75; 41 -12.675,-9.25; 42 -12.675,-9.75; 43 -12.675,-10.25; 44 -12.675,-10.75; 89 12.675,-10.75; 90 12.675,-10.25; 91 12.675,-9.75; 92 12.675,-9.25; 93 12.675,-8.75; 94 12.675,-8.25; 95 12.675,-7.75; 96 12.675,-7.25; 97 12.675,-6.75; 98 12.675,-6.25; 99 12.675,-5.75; 100 12.675,-5.25; 101 12.675,-4.75; 102 12.675,-4.25; 103 12.675,-3.75; 104 12.675,-3.25; 105 12.675,-2.75; 106 12.675,-2.25; 107 12.675,-1.75; 108 12.675,-1.25; 109 12.675,-0.75; 110 12.675,-0.25; 111 12.675,0.25; 112 12.675,0.75; 113 12.675,1.25; 114 12.675,1.75; 115 12.675,2.25; 116 12.675,2.75; 117 12.675,3.25; 118 12.675,3.75; 119 12.675,4.25; 120 12.675,4.75; 121 12.675,5.25; 122 12.675,5.75; 123 12.675,6.25; 124 12.675,6.75; 125 12.675,7.25; 126 12.675,7.75; 127 12.675,8.25; 128 12.675,8.75; 129 12.675,9.25; 130 12.675,9.75; 131 12.675,10.25; 132 12.675,10.75 | smd 0.254 x 1.372: 45 -10.75,-12.675; 46 -10.25,-12.675; 47 -9.75,-12.675; 48 -9.25,-12.675; 49 -8.75,-12.675; 50 -8.25,-12.675; 51 -7.75,-12.675; 52 -7.25,-12.675; 53 -6.75,-12.675; 54 -6.25,-12.675; 55 -5.75,-12.675; 56 -5.25,-12.675; 57 -4.75,-12.675; 58 -4.25,-12.675; 59 -3.75,-12.675; 60 -3.25,-12.675; 61 -2.75,-12.675; 62 -2.25,-12.675; 63 -1.75,-12.675; 64 -1.25,-12.675; 65 -0.75,-12.675; 66 -0.25,-12.675; 67 0.25,-12.675; 68 0.75,-12.675; 69 1.25,-12.675; 70 1.75,-12.675; 71 2.25,-12.675; 72 2.75,-12.675; 73 3.25,-12.675; 74 3.75,-12.675; 75 4.25,-12.675; 76 4.75,-12.675; 77 5.25,-12.675; 78 5.75,-12.675; 79 6.25,-12.675; 80 6.75,-12.675; 81 7.25,-12.675; 82 7.75,-12.675; 83 8.25,-12.675; 84 8.75,-12.675; 85 9.25,-12.675; 86 9.75,-12.675; 87 10.25,-12.675; 88 10.75,-12.675; 133 10.75,12.675; 134 10.25,12.675; 135 9.75,12.675; 136 9.25,12.675; 137 8.75,12.675; 138 8.25,12.675; 139 7.75,12.675; 140 7.25,12.675; 141 6.75,12.675; 142 6.25,12.675; 143 5.75,12.675; 144 5.25,12.675; 145 4.75,12.675; 146 4.25,12.675; 147 3.75,12.675; 148 3.25,12.675; 149 2.75,12.675; 150 2.25,12.675; 151 1.75,12.675; 152 1.25,12.675; 153 0.75,12.675; 154 0.25,12.675; 155 -0.25,12.675; 156 -0.75,12.675; 157 -1.25,12.675; 158 -1.75,12.675; 159 -2.25,12.675; 160 -2.75,12.675; 161 -3.25,12.675; 162 -3.75,12.675; 163 -4.25,12.675; 164 -4.75,12.675; 165 -5.25,12.675; 166 -5.75,12.675; 167 -6.25,12.675; 168 -6.75,12.675; 169 -7.25,12.675; 170 -7.75,12.675; 171 -8.25,12.675; 172 -8.75,12.675; 173 -9.25,12.675; 174 -9.75,12.675; 175 -10.25,12.675; 176 -10.75,12.675
SMD_3225 = smd 1.6 x 1.4: 1 -1.2,-0.9; 2 1.2,-0.9; 3 1.2,0.9; 4 -1.2,0.9
SMD_X_2_PADS = smd 1.9 x 1.1: P$1 0,1.25; P$2 0,-1.25

### Placement (x,y rotation side)
C2  3.7,76.5 90 top
C3  3.7,75.6 90 top
C4  3.7,74.6 90 top
C6  40.7,62.7 90 bottom
C7  51.7,43.9 0 top
C8  49.2,19.55 0 top
C9  38.8,63.6 90 bottom
C10  40.7,59.9 90 bottom
C11  48.2,19.55 0 top
C12  40.7,52.3 90 bottom
C13  40.7,68.3 90 bottom
C14  54.4,43.9 180 top
C15  52.3,18.8 270 top
C16  70,8 270 top
C17  44.2,70.75 180 bottom
C18  49.7,16.9 180 top
C19  47.2,43.6 0 top
C20  48.6,50.5 180 bottom
C21  49.8,70.7 180 bottom
C22  50.7,70.7 180 bottom
C23  52.15,50.45 180 bottom
C24  49.05,43.6 0 top
C25  57.1,70.7 180 bottom
C26  60,57.2 90 bottom
C27  61.2,69.2 180 bottom
C28  59.95,58.4 90 bottom
C29  76.8,57.4 90 top
C30  56.3,50.4 180 bottom
C31  60.6,51.1 270 bottom
J1  93.4,68.5 270 top
J2  57.9,7.4 90 top
J3  22.5,92.4 180 top
J4  43.4,89.8 0 top
J5  72.5,2 0 top
JP1  17,48.8 90 top
JP2  84.3,42.3 270 top
JP3  78.2,89.6 0 top
L1  4.3,81.9 0 top
LED1  6.8,73.7 270 top
R1  3.7,73.7 270 top
R2  49.1,25.8 270 top
R3  49.1,26.7 270 top
R4  71.1,10.5 0 top
R5  71.9,10.5 0 top
R6  72.7,10.5 0 top
R7  70,7 90 top
R8  68.4,57.8 90 bottom
R9  68.4,58.6 90 bottom
R10  74.9,57.4 270 top
R11  53.3,45.7 270 top
R12  69.8,50.9 180 bottom
R13  71.4,50.55 270 bottom
U1  20.3,14.5 0 top
U2  51.7,22.3 270 top
U5  50.6,60.3 90 top
X1  53.1,40.6 0 top
X2  46.8,41.1 90 top

### Tracks (layer width: path | path; a pad name or v marks a point on that pad's centre or on a via)
D+
  Top 0.254: R6.P$2 72.7,9.47 72.5,9.28 J5.P$3
D-
  Top 0.254: R5.P$2 71.85,10.12 J5.P$2
ETH  (via drill 0.35)
  Top 0.254: U5.9 43.85,45.15 34.99,36.29 v34.99,28.7
  Bottom 0.254: v34.99,28.7 34.99,26.41 U1.P20
ETH_CRS_DV  (via drill 0.35)
  Top 0.254: U5.13 45.85,44.15 38.7,37 38.7,17.1 37.85,16.25 v37.2,16.25
  Bottom 0.254: v37.2,16.25 U1.P16
ETH_IRQ14  (via drill 0.35)
  Top 0.254: U5.159 27.15,58.05 v27,58.3 | v11,26.4 v7,26.4
  Bottom 0.254: U1.P10 v7,26.4 | v27,58.3 27,54.4 32.6,48.8 32.6,29.7 29.3,26.4 v11,26.4
ETH_MDC  (via drill 0.35)
  Top 0.254: U5.4 41.35,45.75 31.7,36.1 31.7,19.8 v31.6,19.7
  Bottom 0.254: U1.P15 33.8,14.9 33.8,18.9 32.97,19.73 31.63,19.73 v31.6,19.7
ETH_MDIO  (via drill 0.35)
  Top 0.254: U5.5 41.85,45.65 32.3,36.1 32.3,19.07 v32,18.77
  Bottom 0.254: v32,18.77 33.37,17.4 33.37,12.79 U1.P14
ETH_RESET  (via drill 0.35)
  Top 0.254: v7,23.85 12.55,18.3 v30.3,18.3 | U5.172 34.3,51.55 33.6,52.25 v33.1,52.25
  Bottom 0.254: v7,23.85 U1.P9 | v30.3,18.3 30.3,19.6 33.6,22.9 33.6,51.75 v33.1,52.25
ETH_RX_ER  (via drill 0.35)
  Top 0.254: U5.12 45.35,44.35 38.13,37.13 38.13,19.73 v37.2,18.8
  Bottom 0.254: v37.2,18.8 35.02,18.8 U1.P17
ETH_RXD0  (via drill 0.35)
  Top 0.254: U5.10 44.35,44.85 36.15,36.65 v36.15,28.75
  Bottom 0.254: U1.P19 36.15,25.01 v36.15,28.75
ETH_RXD1  (via drill 0.35)
  Top 0.254: U5.11 44.85,44.65 37.1,36.9 v37.1,21.3
  Bottom 0.254: v37.1,21.3 35.02,21.3 U1.P18
ETH_TXD0  (via drill 0.35)
  Top 0.254: U5.8 43.35,45.38 33.8,35.83 33.8,17.8 32.3,16.3 v7.1,16.3
  Bottom 0.254: U1.P6 7.04,16.24 v7.1,16.3
ETH_TXD1  (via drill 0.35)
  Top 0.254: U5.7 42.85,45.45 33.35,35.95 33.35,18.25 32,16.9 9.1,16.9 v7.1,18.9
  Bottom 0.254: U1.P7 6.98,18.78 v7.1,18.9
ETH_TXD_EN  (via drill 0.35)
  Top 0.254: U5.6 42.35,45.55 32.85,36.05 32.85,18.65 31.8,17.6 9.4,17.6 7,20 v7,21.4
  Bottom 0.254: U1.P8 6.92,21.32 v7,21.4
GND  (via drill 0.35)
  Top 0.152: 22.6,89.1 v22.4,89.1
  Top 0.254: U5.124 43.85,70 45.9,70 | U5.111 50.35,70 45.9,70 | U5.22 50.35,50.5 | 60.7,57.05 U5.60 | 60.7,49.55 60.7,57.05 | U5.63 60.7,58.55 60.7,57.05 | U5.35 56.85,49.75 56.8,49.8 | J5.P$5 73.8,6.4 | U5.45 60.25,49.55 57.9,51.9 | 45.9,70 45.9,66.7 45.5,66.3 | C29.P$2 v78.1,57.4
  Bottom 0.152: v22.4,89.1 22.4,92.3 J3.P$1
  Bottom 0.813: U1.P2 5.78,6.08 v7.8,8.1
  other vias: 63.4,47.9 28.5,81.9 62.5,71.75 37.1,46.7 37,74.2 94.5,74.3 18.5,30.6 18.2,73.2 12.4,10.9
  pour Top: 41.9,49.5 39.9,51.5 39.8,51.5 39.8,70.7 39.9,70.8 61.2,70.8 61.2,49.5
  pour Bottom (no thermals): 48.2,0 48.2,13 67,13 67,0 100,0 100,100 0,100 0,0
  pour Top (no thermals): 48.2,13 67,13 67,6.1 79,6.1 79,0 100,0 100,100 0,100 0,0 48.2,0
GND1  (via drill 0.35)
  other vias: 30.3,95.8
GNDE  (via drill 0.35, 0.7)
  Top 0.813: v50.3,2.6 49.29,1.7 15.1,1.7 14,2.8 v14,2.9 | v5.6,32.1 5.5,32.2 v1.57,32.2
  Bottom 0.813: J3.P$4 7.6,92.4 1.42,86.22 1.42,32.2 v1.57,32.2 | v5.6,32.1 9.9,27.8 9.9,10 14,5.9 v14,2.9
  pour Bottom (no thermals): 49,12.7 49,0 66.6,0 66.6,12.7
  pour Top (no thermals): 49,12.7 66.6,12.7 66.6,5.8 78.6,5.8 78.6,0 49,0
IIC_SCL  (via drill 0.35)
  Top 0.254: U5.51 69.49,52.55 v69.84,52.2
  Bottom 0.254: J4.P$18 52.29,91.09 53.4,92.2 55.3,92.2 56.4,91.1 56.4,81.9 61,77.3 69.83,77.3 72.9,74.22 72.9,51.96 72.44,51.5 70.54,51.5 v69.84,52.2 69.79,52.15 R12.P$2
IIC_SDA  (via drill 0.35)
  Top 0.254: U5.50 68.75,52.05 69.6,51.2 73.2,51.2 v73.5,51.5
  Bottom 0.254: J4.P$16 51.33,92.65 55.45,92.65 56.85,91.25 56.85,82.03 61.12,77.75 70.65,77.75 73.5,74.9 v73.5,51.5 72.55,50.55 R13.P$2
LS_4  (via drill 0.35)
  Top 0.254: U5.132 39.85,82.45 38.5,83.8 32.84,83.8 29.14,87.5 v27.74,87.5
  Bottom 0.254: v27.74,87.5 28.34,88.1 28.34,92.74 28.9,93.3 39.09,93.3 39.59,92.8 J4.P$8
LS_5  (via drill 0.35)
  Top 0.254: U5.131 40.35,82.65 38.7,84.3 33,84.3 28.8,88.5 v27.6,88.5
  Bottom 0.254: v27.6,88.5 27.7,88.6 27.7,92.9 28.65,93.85 40.58,93.85 42.13,92.3 J4.P$10
LS_6  (via drill 0.35)
  Top 0.254: v69.3,67.9 68.95,67.55 U5.81 | v69.3,74.5 70.6,75.8 v74.24,75.8
  Bottom 0.254: v69.3,67.9 v69.3,74.5 | J4.P$12 47.2,93.6 55.73,93.6 57.8,91.53 57.8,82.3 61.5,78.6 71.44,78.6 v74.24,75.8
M4_DIR  (via drill 0.35)
  Top 0.254: U5.101 v55.35,76.4
  Bottom 0.254: J4.P$7 38.99,88.53 37.5,87.04 37.5,84.14 40.48,81.16 40.48,78.52 41.1,77.9 47.4,77.9 48.64,76.66 55.09,76.66 v55.35,76.4
M4_STEP  (via drill 0.35)
  Top 0.254: U5.42 60.35,43.75 v60.8,43.3
  Bottom 0.254: 47.32,91.18 J4.P$14 47.27,91.07 49.26,93.06 55.7,93.06 57.3,91.45 57.3,82.2 61.34,78.16 70.94,78.16 74.2,74.9 74.2,48.5 69,43.3 v60.8,43.3
N$2
  Top 0.254: U5.27 52.85,45.83 R11.P$2
N$7
  Top 0.254: R1.P$1 LED1.A
N$9  (via drill 0.35)
  Top 0.254: U5.148 35.05,63.55 v34.75,63.25
  Bottom 0.254: C9.P$2 35.1,63.6 v34.75,63.25
N$14  (via drill 0.35)
  Top 0.254: U5.19 48.85,46.4 v48.6,46.15
  Bottom 0.254: v48.6,46.15 C20.P$1
N$17  (via drill 0.35)
  Top 0.254: U5.62 66.35,58.05 v66.7,57.7
  Bottom 0.254: v66.7,57.7 66,58.4 C28.P$1
N$18  (via drill 0.35)
  Top 0.254: U5.64 66.35,59.05 v66.7,58.7
  Bottom 0.254: v66.7,58.7 67.55,57.85 R8.P$2
N$19  (via drill 0.35)
  Top 0.254: U5.65 67.7,59.55 v67.7,59.6
  Bottom 0.254: v67.7,59.6 68.08,59.23 R9.P$2
P1_07  (via drill 0.35)
  Top 0.254: U5.125 43.35,76.2 44.46,77.31 44.71,77.31 51.85,84.45 62.3,84.45 62.94,85.09 62.94,91.07 66.18,94.31 75.29,94.31 v76.95,92.65
  Bottom 0.254: JP3.P$10 76.93,92.63 v76.95,92.65
P1_12  (via drill 0.35)
  Top 0.254: U5.93 59.35,74.2 60.67,75.53 62.58,75.53 63.39,74.71 67.42,74.71 67.81,74.32 67.81,74.29 70.94,71.16 75.17,71.16 77.2,69.13 77.2,68 77.85,67.35 83.25,67.35 90.85,59.75 90.85,37.55 87.5,34.2 v87.5,33.4
  Bottom 0.254: v87.5,33.4 JP2.P$18
P1_13  (via drill 0.35)  (1 unrouted)
  Top 0.254: U5.94 58.85,74.46 60.4,76 62.99,76 63.89,75.11 67.59,75.11 71.11,71.6 75.38,71.6 77.61,69.37 77.61,68.39 78.14,67.86 83.34,67.86 91.3,59.9 91.3,35.4 87.8,31.9 v87.8,30.9
  Bottom 0.254: v87.8,30.9 87.75,30.95 85.58,30.95 85.58,30.9
P1_14  (via drill 0.35)
  Top 0.254: U5.95 58.35,74.95 59.88,76.48 89.75,76.48 93.38,80.1 93.38,91.82 91.05,94.15 80.95,94.15 v79.45,92.65
  Bottom 0.254: v79.45,92.65 79.45,90.89 JP3.P$12
P1_15  (via drill 0.35)
  Top 0.254: U5.96 57.85,75.03 59.71,76.89 89.59,76.89 92.97,80.27 92.97,91.66 90.91,93.72 83.07,93.72 v82,92.65
  Bottom 0.254: JP3.P$14 v82,92.65
P001_AN001  (via drill 0.35)
  Top 0.254: U5.168 27.45,53.55 23,49.1 23,41.6 20.3,38.9 v20.3,37.35
  Bottom 0.254: v20.3,37.35 18.29,37.35 JP1.P$1
P2_00  (via drill 0.35)
  Top 0.254: U5.69 77.25,61.55 79.85,58.95 79.85,48.15 81.15,46.85 v81.15,46.1
  Bottom 0.254: v81.15,46.1 JP2.P$7
P2_07  (via drill 0.35)
  Top 0.254: U5.49 68.55,51.55 69.4,50.7 76.15,50.7 77.05,49.8 77.05,36.45 80.25,33.25 80.25,31.75 v81.15,30.85
  Bottom 0.254: v81.15,30.85 81.17,30.87 JP2.P$19
P002_AN002  (via drill 0.35)
  Top 0.254: U5.167 27.35,54.05 22.5,49.2 22.5,43.5 20.1,41.1 v20.1,39.9
  Bottom 0.254: v20.1,39.9 JP1.P$3
P003  (via drill 0.35)
  Top 0.254: U5.166 27.27,54.55 22.05,49.33 22.05,45.45 20.1,43.5 v20.1,42.5
  Bottom 0.254: v20.1,42.5 20.05,42.45 JP1.P$5
P3_01  (via drill 0.35)
  Top 0.254: U5.87 64.92,70.55 v65.39,71.02
P3_03  (via drill 0.35)
  Top 0.254: v87.6,36 87.6,37.1 90.4,39.9 90.4,59.5 83.1,66.8 76.64,66.8 75.77,67.67 70.73,67.67 68.85,69.55 U5.85
  Bottom 0.254: JP2.P$16 87.55,35.95 v87.6,36
P3_06  (via drill 0.35)
  Top 0.254: U5.80 74.05,67.05 74.26,67.26 75.6,67.26 76.49,66.38 82.88,66.38 89.91,59.34 89.91,42.01 87.4,39.5 v87.4,38.5
  Bottom 0.254: JP2.P$14 v87.39,38.49 v87.4,38.5
P3_07  (via drill 0.35)
  Top 0.254: U5.79 74.21,66.54 74.53,66.86 75.24,66.86 76.19,65.91 82.67,65.91 89.46,59.12 89.46,43.86 87.3,41.7 v87.3,41
  Bottom 0.254: JP2.P$12 87.27,41.03 v87.3,41
P3_09  (via drill 0.35)
  Top 0.254: U5.77 63.33,65.5 82.4,65.5 89,58.9 89,46.1 87.4,44.5 v87.4,43.6
  Bottom 0.254: JP2.P$10 87.37,43.57 v87.4,43.6
P3_10  (via drill 0.35)
  Top 0.254: U5.76 82.15,65.05 88.55,58.65 88.55,48.05 87.5,47 v87.5,46.2
  Bottom 0.254: JP2.P$8 87.41,46.11 v87.5,46.2
P3_11  (via drill 0.35)
  Top 0.254: U5.75 81.95,64.55 88.1,58.4 88.1,50.5 87.4,49.8 v87.4,48.7
  Bottom 0.254: JP2.P$6 87.35,48.65 v87.4,48.7
P3_12  (via drill 0.35)
  Top 0.254: U5.74 81.75,64.05 87.45,58.35 v87.45,51.21 v87.44,51.2
  Bottom 0.254: JP2.P$4 v87.44,51.2
P3_13  (via drill 0.35)
  Top 0.254: v81.2,33.4 81.2,34.2 77.5,37.9 77.5,53.9 76.84,54.56 70.53,54.56 70.52,54.55 U5.55
  Bottom 0.254: JP2.P$17 v81.21,33.41 v81.2,33.4
P3_14  (via drill 0.35)
  Top 0.254: U5.56 77.15,55.05 78,54.2 78,39.9 81.2,36.7 v81.2,35.95
  Bottom 0.254: v81.2,35.95 JP2.P$15
P3_15  (via drill 0.35)
  Top 0.254: U5.57 77.22,55.56 78.46,54.32 78.46,41.94 81.2,39.2 v81.2,38.5
  Bottom 0.254: JP2.P$13 v81.21,38.49 v81.2,38.5
P004_AN100  (via drill 0.35)
  Top 0.254: U5.165 27.2,55.05 21.6,49.45 21.6,47.7 20.3,46.4 v20.3,45
  Bottom 0.254: v20.3,45 v20.29,44.99 JP1.P$7
P5_01_AN116  (via drill 0.35)
  Top 0.254: v13.5,44.9 9.4,49 9.4,62 14.45,67.05 U5.141
  Bottom 0.254: JP1.P$8 13.59,44.99 v13.5,44.9
P5_02_AN017  (via drill 0.35)
  Top 0.254: U5.142 15.25,66.55 10.2,61.5 10.2,50.3 13,47.5 v13.5,47.5
  Bottom 0.254: JP1.P$10 13.53,47.53 v13.5,47.5
P5_03_AN117  (via drill 0.35)
  Top 0.254: v13.5,50.1 11,52.6 11,61.3 15.75,66.05 U5.143
  Bottom 0.254: JP1.P$12 13.53,50.07 v13.5,50.1
P5_04_AN018  (via drill 0.35)
  Top 0.254: U5.144 16.45,65.55 11.6,60.7 11.6,54.2 13.2,52.6 v13.5,52.6
  Bottom 0.254: JP1.P$14 v13.51,52.61 v13.5,52.6
P5_05_AN118  (via drill 0.35)
  Top 0.254: v13.5,55.15 12.2,56.45 12.2,60.48 16.77,65.05 U5.145
  Bottom 0.254: JP1.P$16 v13.5,55.15
P5_06_AN019  (via drill 0.35)
  Top 0.254: v13.5,57.7 12.8,58.4 12.8,60.5 16.85,64.55 U5.146
  Bottom 0.254: JP1.P$18 v13.51,57.69 v13.5,57.7
P5_07_AN119  (via drill 0.35)
  Top 0.254: U5.147 17.35,64.05 v13.5,60.2
  Bottom 0.254: JP1.P$20 13.53,60.23 v13.5,60.2
P5_11  (via drill 0.35)
  Top 0.254: U5.176 28.75,49.55 28.3,49.1 25.3,49.1 24.5,48.3 24.5,39 20.5,35 14.5,35 12.5,37 12.5,41.3 v13.6,42.4
  Bottom 0.254: JP1.P$6 13.65,42.45 v13.6,42.4
P5_13  (via drill 0.35)
  Top 0.254: v13.7,39.9 13,39.2 13,37.12 14.68,35.45 20.25,35.45 24,39.2 24,48.6 25.95,50.55 U5.174
  Bottom 0.254: JP1.P$4 v13.71,39.91 v13.7,39.9
P6_00  (via drill 0.35)
  Top 0.254: U5.122 44.85,74.32 44.86,74.33 44.86,74.87 44.24,75.49 44.24,76.52 44.63,76.91 44.91,76.91 52,84 62.45,84 63.35,84.9 63.35,90.9 66.25,93.8 73.25,93.8 v74.4,92.65
  Bottom 0.254: v74.4,92.65 JP3.P$8
P6_02  (via drill 0.35)
  Top 0.254: U5.120 45.85,77.2 52.2,83.55 62.65,83.55 63.79,84.69 63.79,90.76 66.33,93.31 71.14,93.31 v71.85,92.6
  Bottom 0.254: JP3.P$6 v71.85,92.6
P6_03  (via drill 0.35)
  Top 0.254: U5.119 46.34,72.98 46.34,77.12 52.3,83.08 62.76,83.08 64.29,84.62 64.29,90.69 66.2,92.6 v69.3,92.6
  Bottom 0.254: v69.3,92.6 v69.31,92.59 JP3.P$4
P6_05  (via drill 0.35)
  Top 0.254: U5.117 47.35,74.59 47.29,74.66 47.29,75.73 54.23,82.68 62.98,82.68 64.7,84.4 64.7,90.17 v65.22,90.69
  Bottom 0.254: v65.22,90.69 65.4,90.87 JP3.P$2
P6_06  (via drill 0.35)
  Top 0.254: U5.116 47.85,74.67 47.69,74.83 47.69,75.57 54.4,82.27 65.57,82.27 66.8,83.5 v66.8,86.6
  Bottom 0.254: v66.8,86.6 66.8,88.3 JP3.P$1
P6_08  (via drill 0.35)
  Top 0.254: U5.99 56.35,75.09 58.55,77.29 89.42,77.29 92.51,80.39 92.51,91.54 90.74,93.31 84.99,93.31 84.55,92.87 v84.55,92.6
  Bottom 0.254: v84.55,92.6 JP3.P$16
P6_09  (via drill 0.35)
  Top 0.254: U5.100 55.85,75.17 58.38,77.7 89.25,77.7 92.11,80.56 92.11,91.36 90.86,92.6 v87.1,92.6
  Bottom 0.254: JP3.P$18 v87.09,92.59 v87.1,92.6
P6_11  (via drill 0.35)
  Top 0.254: U5.102 54.85,75.97 54.69,76.13 54.69,76.82 56.02,78.14 89.02,78.14 91.4,80.53 v91.4,90.8
  Bottom 0.254: v91.4,90.8 91.3,90.9 89.66,90.9 JP3.P$20
P6_12  (via drill 0.35)
  Top 0.254: U5.103 54.35,75.89 54.29,75.96 54.29,76.99 55.85,78.55 88.55,78.55 89.65,79.65 v89.65,86.6
  Bottom 0.254: JP3.P$19 89.63,86.62 v89.65,86.6
P6_13  (via drill 0.35)
  Top 0.254: U5.104 53.88,73 53.88,77.15 55.68,78.96 84.46,78.96 87.2,81.7 v87.2,86.6
  Bottom 0.254: v87.2,86.6 87.2,88.22 JP3.P$17
P6_14  (via drill 0.35)
  Top 0.254: U5.105 53.44,73.07 53.44,77.29 55.51,79.36 82.66,79.36 84.6,81.3 v84.6,86.6
  Bottom 0.254: JP3.P$15 84.6,88.28 v84.6,86.6
P6_15  (via drill 0.35)
  Top 0.254: U5.106 52.94,73.07 52.94,77.37 55.34,79.77 80.87,79.77 82.01,80.91 v82.01,86.59 v82,86.6
  Bottom 0.254: v82,86.6 JP3.P$13
P006_AN102  (via drill 0.35)
  Top 0.254: U5.163 25.62,56.05 21,51.42 21,48.3 v20.2,47.5
  Bottom 0.254: v20.2,47.5 18.3,47.5 JP1.P$9
P007  (via drill 0.35)
  Top 0.254: v20.2,50.1 20.2,51.3 25.45,56.55 U5.162
  Bottom 0.254: v20.2,50.1 20.17,50.07 JP1.P$11
P8_05  (via drill 0.35)
  Top 0.254: U5.173 25.65,51.05 23.5,48.9 23.5,39.4 20,35.9 15.45,35.9 13.95,37.4 v13.75,37.4
  Bottom 0.254: v13.75,37.4 15.7,37.4 JP1.P$2
P008_AN003  (via drill 0.35)
  Top 0.254: U5.161 25.25,57.05 20.8,52.6 v20.2,52.6
  Bottom 0.254: v20.2,52.6 JP1.P$13
P9_00  (via drill 0.35)
  Top 0.254: U5.58 77.35,56.05 78.9,54.5 78.9,43.8 81.1,41.6 v81.1,41
  Bottom 0.254: v81.1,41 83,41 JP2.P$11
P9_01  (via drill 0.35)
  Top 0.254: U5.59 77.42,56.55 79.41,54.57 79.41,46.19 81.1,44.5 v81.1,43.6
  Bottom 0.254: JP2.P$9 81.13,43.57 v81.1,43.6
P9_05  (via drill 0.35)
  Top 0.254: U5.73 81.55,63.55 85.57,59.53 v85.57,56
  Bottom 0.254: v85.57,56 JP2.P$2
P9_06  (via drill 0.35)
  Top 0.254: v83,56.1 83,58.58 78.53,63.05 U5.72
  Bottom 0.254: JP2.P$1 83.03,56.07 v83,56.1
P9_07  (via drill 0.35)
  Top 0.254: U5.71 78.15,62.55 81.2,59.5 v81.2,51.2
  Bottom 0.254: v81.2,51.2 JP2.P$3
P9_08  (via drill 0.35)
  Top 0.254: U5.70 77.72,62.05 80.36,59.42 80.36,50.59 81.2,49.75 v81.2,48.6
  Bottom 0.254: JP2.P$5 81.25,48.65 v81.2,48.6
P009_AN004  (via drill 0.35)
  Top 0.254: U5.160 24.45,57.55 22.05,55.15 v20.15,55.15
  Bottom 0.254: v20.15,55.15 JP1.P$15
P014_DA0_AN005_AN105  (via drill 0.35)
  Top 0.254: U5.152 24.6,61.55 23.9,60.85 23.9,58.8 22.8,57.7 v20.2,57.7
  Bottom 0.254: v20.2,57.7 v20.19,57.69 JP1.P$17
P015_DA1_AN006_AN106  (via drill 0.35)
  Top 0.254: U5.151 24.25,62.05 22.45,60.25 v20.25,60.25
  Bottom 0.254: v20.25,60.25 20.23,60.23 JP1.P$19
PA_00  (via drill 0.35)
  Top 0.254: U5.114 48.94,73.07 48.94,73.78 49.04,73.87 49.04,76.34 54.56,81.86 67.36,81.86 69.31,83.81 69.3,83.82 v69.3,86.5
  Bottom 0.254: JP3.P$3 v69.31,86.51 v69.3,86.5
PA_01  (via drill 0.35)
  Top 0.254: U5.113 49.44,73.07 49.44,76.17 54.73,81.46 69.91,81.46 71.85,83.4 v71.85,86.55
  Bottom 0.254: v71.85,86.55 JP3.P$5
PA_08  (via drill 0.35)
  Top 0.254: U5.107 52.35,77.35 55.2,80.2 77.7,80.2 79.5,82 v79.5,86.6
  Bottom 0.254: JP3.P$11 79.47,86.63 v79.5,86.6
PA_09  (via drill 0.35)
  Top 0.254: U5.108 51.94,73.07 51.94,77.52 55.03,80.61 74.31,80.61 76.93,83.23 76.93,86.57 v76.9,86.6
  Bottom 0.254: v76.9,86.6 76.9,88.3 JP3.P$9
PA_10  (via drill 0.35)
  Top 0.254: U5.109 51.44,73.07 51.44,77.59 54.9,81.05 71.95,81.05 74.4,83.5 v74.4,86.6
  Bottom 0.254: JP3.P$7 v74.4,86.6
RELAY_1  (via drill 0.35)
  Top 0.254: U5.68 68.73,61.05 v69.34,60.44
  Bottom 0.254: v69.34,60.44 70.3,61.4 70.3,74.45 69.15,75.6 60.16,75.6 57.4,78.36 50.74,78.36 49.75,79.35 J4.P$15
RELAY_2  (via drill 0.35)
  Top 0.254: v70.9,53.8 70.7,53.8 70.45,54.05 U5.54
  Bottom 0.254: J4.P$17 52.29,79.61 53.14,78.76 57.64,78.76 60.39,76.01 69.37,76.01 70.9,74.47 v70.9,53.8
RELAY_3  (via drill 0.35)
  Top 0.254: v71.49,53.1 70.59,53.1 70.14,53.55 U5.53
  Bottom 0.254: J4.P$19 54.83,79.97 55.63,79.17 57.9,79.17 60.66,76.41 69.54,76.41 71.65,74.3 71.65,53.24 71.51,53.1 v71.49,53.1
RELAY_4  (via drill 0.35)
  Top 0.254: U5.52 70,53.05 70.81,52.23 70.89,52.24 v72.19,52.24
  Bottom 0.254: J4.P$20 55.9,90 55.9,81.74 60.83,76.82 69.73,76.82 72.25,74.3 72.25,52.3 v72.19,52.24
RESET  (via drill 0.35)
  Top 0.254: U5.67 68.15,60.55 69.9,58.8 v75.6,58.8 75.6,57.77 R10.P$1 C29.P$1
  Bottom 0.254: v75.6,58.8 75.6,63.6 76.5,64.5 90.7,64.5 91.69,63.51 91.69,62.01 92.1,61.6 92.1,59.5 93.26,58.34 J1.9
TCK  (via drill 0.35)
  Top 0.254: v76.3,68.1 71.3,68.1 67.65,71.75 64.97,71.75 64.28,71.05 U5.88
  Bottom 0.254: v76.3,68.1 76.9,67.5 76.9,66.1 78,65 90.9,65 92.1,63.8 92.1,62.18 J1.7
TDI  (via drill 0.35)
  Top 0.254: U5.91 60.34,73.92 60.98,74.55 61.85,74.55 63.05,73.35 67.9,73.35 70.75,70.5 v74.9,70.5
  Bottom 0.254: v74.9,70.5 76.1,70.5 78.25,68.35 78.25,67 78.75,66.5 91.4,66.5 J1.1
TDO  (via drill 0.35)
  Top 0.254: v75.6,69.7 70.9,69.7 67.7,72.9 62.7,72.9 61.5,74.1 61.17,74.1 60.85,73.78 U5.90
  Bottom 0.254: v75.6,69.7 76.3,69.7 77.8,68.2 77.8,66.55 78.39,65.96 J1.3
TMS  (via drill 0.35)
  Top 0.254: U5.89 61.35,73.2 62.1,72.45 67.55,72.45 71.15,68.85 v74.95,68.8
  Bottom 0.254: v74.95,68.8 76.62,68.8 77.36,68.06 77.36,66.24 78.14,65.46 91.54,65.46 93.4,63.6 J1.5
USB_N
  Top 0.254: U5.46 66.87,50.05 71.9,45.02 R5.P$1
USB_P
  Top 0.254: U5.47 67.2,50.55 72.7,45.05 R6.P$1
USB_VBUS_B
  Top 0.254: R4.P$1 71.1,44.8 69.7,46.2 61.7,46.2 61.35,46.55 U5.44
USBHS_FAULT  (via drill 0.35)
  Top 0.254: U2.3 50.75,25.25 50.2,25.8 R2.P$1 49.42,25.27 v49.9,24.8 | U5.78 74.75,66.05 v74.9,66.2
  Bottom 0.254: v49.9,24.8 68.5,24.8 74.9,31.2 v74.9,66.2
USBHS_N
  Top 0.152: 56.6,14.91 J2.D-
  Top 0.254: U5.31 54.85,45.15 56.6,43.4 56.6,14.91
USBHS_P
  Top 0.254: U5.32 55.35,45.35 57.2,43.5 57.2,18.11 58.9,16.41 J2.D+
USBHS_VBUS  (via drill 0.35)
  Top 0.254: U5.17 47.85,45.62 v47.97,45.5 | U2.5 52.65,20 | 52.65,20 52.65,19.37 52.65,18.83 C15.P$1 52.62,17.2 | 52.62,17.2 51.4,17.2 C18.1 | J2.VBUS 54.3,14.71 54.3,16.7 53.8,17.2 52.62,17.2 | v51.62,19.82 52.47,19.82 52.65,20
  Bottom 0.254: v47.97,45.5 47.97,20.93 49.09,19.82 v51.62,19.82
USBHS_VBUSEN  (1 unrouted)
  Top 0.254: R3.P$1 51.9,26.7 52.65,25.95 U2.1
VBUS
  Top 0.254: J5.P$1 71.2,7 | 71.2,7 71.2,8 | R4.P$2 71.1,9.38 71.2,9.28 71.2,8 | R7.P$2 71.2,7 | C16.P$1 71.2,8
VCL_F(FLASH)  (via drill 0.35)
  Top 0.254: U5.112 49.85,75.35 v50.5,76
  Bottom 0.254: C21.P$2 49.8,75.3 v50.5,76
VDD  (via drill 0.35)  (5 unrouted)
  Top 0.254: U5.97 57.35,74.55 v57.1,74.8 | U5.110 50.85,74.55 v50.7,74.7 | U5.149 35.9,63.05 v35.7,62.85 | U5.138 36.55,68.55 v36.3,68.3 | U5.171 34.95,52.05 v34.7,52.3 | U5.155 36.35,60.05 v36.2,59.9 | U5.25 51.85,46.71 v52.16,46.4 52.35,46.59 U5.26 | U5.61 64.85,57.55 v65.1,57.3 66.07,57.3 66.36,57.01 74.18,57.01 R10.P$2 | U5.123 44.35,74.45 v44.2,74.6 | U5.84 65,69.05 v65.3,68.75 | U5.34 56.35,46.35 v56.3,46.3 | U5.48 67.96,51.05 v68.5,50.51
  Top 0.508: R1.P$2 2.3,73.7 2.2,73.8 | C4.P$1 2.2,74.6 | C3.P$1 2.2,75.6 | C2.P$1 2,76.5
  Top 1.016: L1.2 2,78.4 2,72.9 3.6,71.3 v5.9,71.3
  Bottom 0.254: v35.7,62.85 40.23,62.85 C6.P$2 40.38,63.48 42,65.1 43,65.1 | v36.2,59.9 C10.P$2 40.38,60.01 40.67,60.58 40.7,60.6 47.5,60.6 47.8,60.3 | v65.1,57.3 60.42,57.3 C26.P$1 60.33,56.73 60.27,56.67 53.93,56.67 50.3,60.3 | v65.3,68.75 61.33,68.75 C27.P$1 61.42,68.65 56.1,68.65 56.1,70.6 56.52,71.03 C25.P$2 v57.1,74.8 | v34.7,52.3 C12.P$2 40.38,52.58 40.9,53.1 50.3,53.1 | v52.16,46.4 C23.P$1 52.2,50.08 C30.P$1 | v36.3,68.3 C13.P$2 40.38,67.72 40.6,67.5 43,67.5 | v44.2,74.6 C17.P$2 43.48,71.08 43,70.6 43,68.65 | v50.7,74.7 C22.P$2 51.27,71.03 51.5,70.8 51.5,68.65 | v56.3,46.3 C30.P$1 | C30.P$1 60.09,50.08 60.75,50.73 60.75,50.93 C31.P$2 67.91,51.1 v68.5,50.51 69.73,50.51 R12.P$1 71.05,50.58 R13.P$1
  Bottom 0.508: 45,68.65 43,68.65 42.7,68.65 | 45,68.65 50.3,68.65 | 45.4,69.05 45,68.65 | 50.3,60.3 50.3,53.1 50.3,50.4 50.58,50.12 C23.P$1 | 51.5,68.65 55.95,68.65
  Bottom 1.016: 4.19,31.69 8.59,27.29 8.59,12.21 U1.P3 7.54,11.16 U1.P4 | 26.4,89 26.4,87 31.1,82.3 36.5,82.3 38.48,80.33 38.48,72.88 42.7,68.65
  Bottom 1.27: 4.19,31.69 4.19,69.2 5.9,70.91 v5.9,71.3 5.9,82.5 10,86.6 24,86.6 26.4,89 26.4,94.9 29.65,98.15 96.31,98.15 98.35,96.11 98.35,70.91 J1.2 | 51.5,68.65 50.3,68.65 43,68.65 43,67.5 43,65.1 47.8,60.3 50.3,60.3
  Bottom 2.54: J1.2 J1.4
VDD5  (via drill 0.35)
  Top 0.254: U2.4 50.75,20.15 50.5,19.9 49.23,19.9 | 49.23,19.9 C8.P$1 C11.P$1 47.02,19.88 v47,19.9 | R3.P$2 R2.P$2 48.77,20.35 49.23,19.9
  Bottom 0.813: v47,19.9 47,7.4 41.02,1.42 4.09,1.42 2.91,2.6 2.91,84.27 7.02,88.38 10.86,88.38 J3.P$3
VDDIN  (via drill 0.35)
  Top 0.813: v18.6,88.4 13.3,83.1 L1.1
  Bottom 0.813: v18.6,88.4 18.69,88.49 J3.P$2
X_DIR  (via drill 0.35)
  Top 0.254: v47,76.7 46.85,76.55 U5.118
  Bottom 0.254: J4.P$3 35.17,88.53 36.6,87.1 36.6,83.89 39.67,80.82 39.67,77.73 40.5,76.9 46.8,76.9 v47,76.7
X_LS  (via drill 0.35)
  Top 0.254: U5.164 26.5,55.55 v26.3,55.35 | v26.2,79.6 26.2,88.1 v29.1,91
  Bottom 0.254: v26.2,79.6 26.3,79.5 v26.3,55.35 | v29.1,91 31.9,91 J4.P$2
X_STEP  (via drill 0.35)
  Top 0.254: U5.86 65.61,70.05 65.83,70.27 v67.83,70.27
  Bottom 0.254: J4.P$11 44.67,79.83 45.79,78.71 48.09,78.71 49.29,77.51 56.99,77.51 59.78,74.72 67.42,74.72 67.83,74.3 v67.83,70.27
XCIN  (1 unrouted)
  Top 0.2: 45.55,41.7 45.55,41.4
  Top 0.254: U5.20 49.35,45.95 47.33,43.92 C19.P$1 46.52,43.92 45.55,42.95 45.55,41.7
XCOUT
  Top 0.2: 48.05,41.5 X2.P$2
  Top 0.254: U5.21 49.85,44.73 C24.P$1 48.42,43.92 48.05,43.55 48.05,41.5
XTAL1
  Top 0.152: 52,39.7 X1.1
  Top 0.254: 52,39.7 52.82,39.7 53.1,39.98 53.1,43.5 52.38,44.23 C7.P$1 51.27,44.23 50.85,44.65 U5.23
XTAL2
  Top 0.2: 54.3,41.6 X1.3
  Top 0.254: U5.24 51.35,46.05 53.83,43.58 C14.P$1 54.3,43.48 54.3,41.6
Y_DIR  (via drill 0.35)
  Top 0.254: U5.115 v48.35,75.1
  Bottom 0.254: v48.35,75.1 47.7,75.75 47.7,77 47.3,77.4 40.6,77.4 40.08,77.92 40.08,80.99 37.05,84.01 J4.P$5
Y_LS  (via drill 0.35)
  Top 0.254: U5.175 28.25,50.05 v28,49.8 | v25.5,80.3 25.5,88.35 28.85,91.7 v29.9,91.7
  Bottom 0.254: v28,49.8 28,52.7 25.5,55.2 v25.5,80.3 | v29.9,91.7 30.35,92.15 33.43,92.15 J4.P$4
Y_STEP  (via drill 0.35)
  Top 0.254: U5.82 65.5,68.05 65.54,68.09 67.97,68.09 68.48,68.6 v68.5,68.6
  Bottom 0.254: v68.5,68.6 68.5,74.3 67.65,75.15 59.95,75.15 57.15,77.95 49.55,77.95 48.3,79.2 47.8,79.2 47.21,79.79 J4.P$13
Z_DIR  (via drill 0.35)
  Top 0.254: U5.121 45.35,75.8 v44.9,76.25
  Bottom 0.254: v44.9,76.25 44.55,76.4 40.3,76.4 39.26,77.44 39.26,80.65 36.17,83.74 36.17,86.73 35.47,87.43 33.07,87.43 J4.P$1
Z_LS  (via drill 0.35)
  Top 0.254: v24.7,81.2 24.7,88.4 28.85,92.55 v29.2,92.55 | v27.26,52.4 27.91,53.05 U5.169
  Bottom 0.254: v24.7,81.2 24.8,81.1 24.8,54.86 v27.26,52.4 | J4.P$6 35.47,92.65 29.3,92.65 v29.2,92.55
Z_STEP  (via drill 0.35)
  Top 0.254: U5.92 59.85,74 60.9,75.05 62.05,75.05 63.05,74.05 v67.15,74.05
  Bottom 0.254: v67.15,74.05 59.85,74.05 56.8,77.1 49,77.1 47.79,78.31 43.59,78.31 42.13,79.77 J4.P$9